# EAGLE design Eddy Backplane (EAGLE 9.5.2)

## Sheet 1 of 3: Back Plane
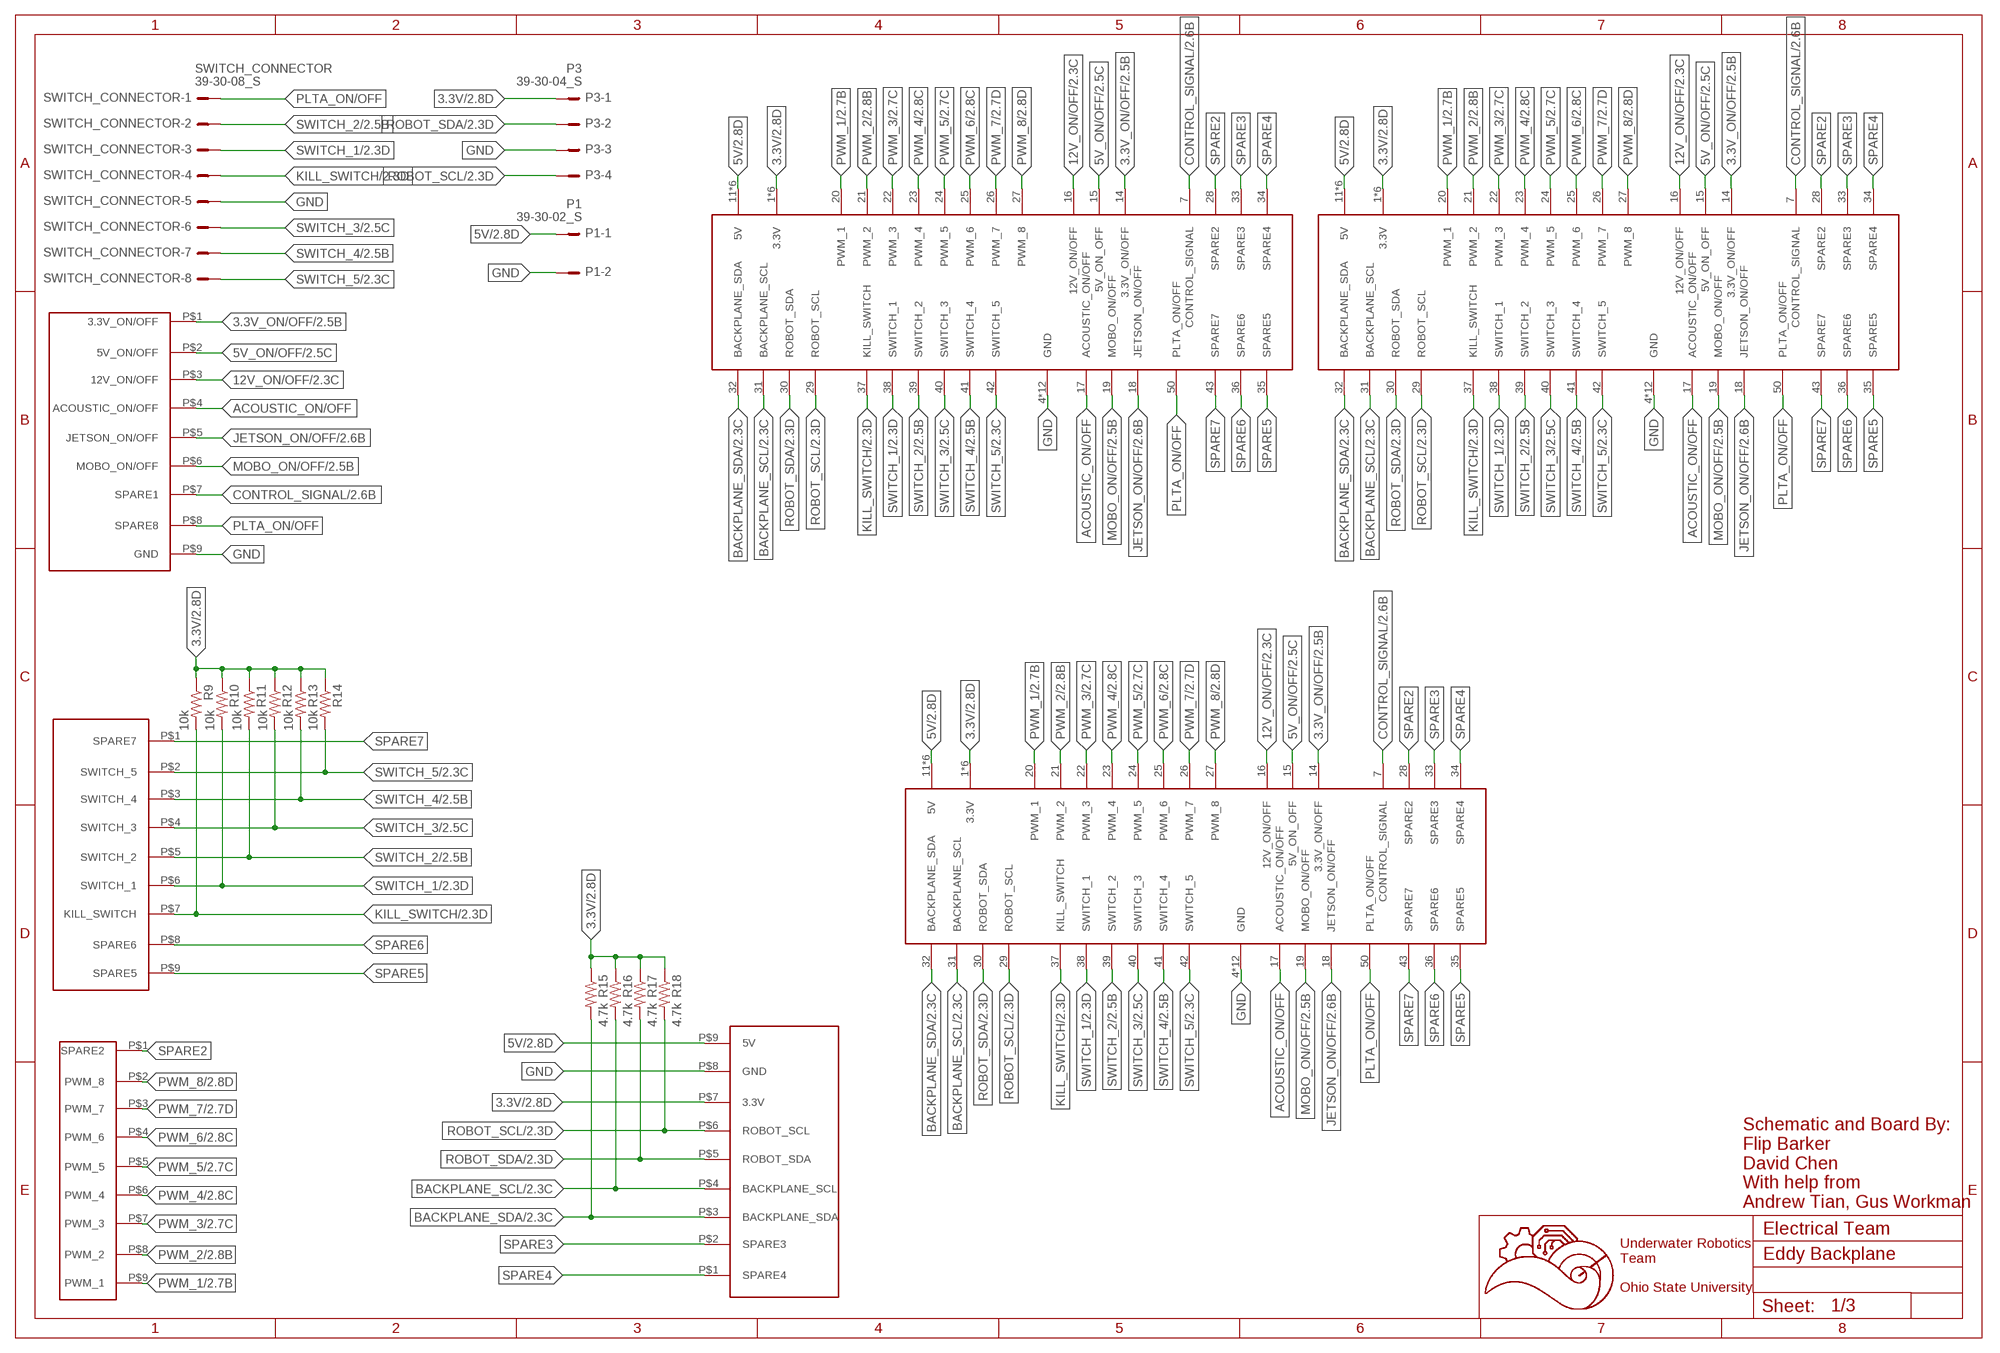
[diagram p0: schematic, sheet 1]

### Parts
P1  39-30-02_S  [39-30-?02?]
P3  39-30-04_S  [39-30-?04?]
PWR_ON  929870-01-09_3  [929852-01-09_1ROW]
R9  10k  R-US_R0603  [R0603]
R10  10k  R-US_R0603  [R0603]
R11  10k  R-US_R0603  [R0603]
R12  10k  R-US_R0603  [R0603]
R13  10k  R-US_R0603  [R0603]
R14  10k  R-US_R0603  [R0603]
R15  4.7k  R-US_R0603  [R0603]
R16  4.7k  R-US_R0603  [R0603]
R17  4.7k  R-US_R0603  [R0603]
R18  4.7k  R-US_R0603  [R0603]
SWITCH_CONN  929870-01-09_1  [929852-01-09_1ROW]
SWITCH_CONNECTOR  39-30-08_S  [39-30-?08?]
U$1  5530843-FEMALE  [5530843-6-BACKPLANEMATE]
U$2  5530843-FEMALE  [5530843-6-BACKPLANEMATE]
U$3  5530843-FEMALE  [5530843-6-BACKPLANEMATE]
U$6  929870-01-09_2  [929852-01-09_1ROW]
U$8  929870-01-09_4  [929852-01-09_1ROW]

### Nets
3.3V: P3.1 R9.1 R10.1 R11.1 R12.1 R13.1 R14.1 R15.1 R16.1 R17.1 R18.1 U$1.1(3.3V) U$1.2(3.3V) U$1.3(3.3V) U$1.54(3.3V) U$1.55(3.3V) U$1.56(3.3V) U$2.1(3.3V) U$2.2(3.3V) U$2.3(3.3V) U$2.54(3.3V) U$2.55(3.3V) U$2.56(3.3V) U$3.1(3.3V) U$3.2(3.3V) U$3.3(3.3V) U$3.54(3.3V) U$3.55(3.3V) U$3.56(3.3V) U$8.P$7(3.3V) ; also sheet 2,3
3.3V_ON/OFF: PWR_ON.P$1(3.3V_ON/OFF) U$1.14(3.3V_ON/OFF) U$2.14(3.3V_ON/OFF) U$3.14(3.3V_ON/OFF) ; also sheet 2
5V: P1.1 U$1.11(5V) U$1.12(5V) U$1.13(5V) U$1.44(5V) U$1.45(5V) U$1.46(5V) U$2.11(5V) U$2.12(5V) U$2.13(5V) U$2.44(5V) U$2.45(5V) U$2.46(5V) U$3.11(5V) U$3.12(5V) U$3.13(5V) U$3.44(5V) U$3.45(5V) U$3.46(5V) U$8.P$9(5V) ; also sheet 2
5V_ON/OFF: PWR_ON.P$2(5V_ON/OFF) U$1.15(5V_ON_OFF) U$2.15(5V_ON_OFF) U$3.15(5V_ON_OFF) ; also sheet 2
12V_ON/OFF: PWR_ON.P$3(12V_ON/OFF) U$1.16(12V_ON/OFF) U$2.16(12V_ON/OFF) U$3.16(12V_ON/OFF) ; also sheet 2
ACOUSTIC_ON/OFF: PWR_ON.P$4(ACOUSTIC_ON/OFF) U$1.17(ACOUSTIC_ON/OFF) U$2.17(ACOUSTIC_ON/OFF) U$3.17(ACOUSTIC_ON/OFF)
BACKPLANE_SCL: R16.2 U$1.31(BACKPLANE_SCL) U$2.31(BACKPLANE_SCL) U$3.31(BACKPLANE_SCL) U$8.P$4(BACKPLANE_SCL) ; also sheet 2
BACKPLANE_SDA: R15.2 U$1.32(BACKPLANE_SDA) U$2.32(BACKPLANE_SDA) U$3.32(BACKPLANE_SDA) U$8.P$3(BACKPLANE_SDA) ; also sheet 2
CONTROL_SIGNAL: PWR_ON.P$7(SPARE1) U$1.7(CONTROL_SIGNAL) U$2.7(CONTROL_SIGNAL) U$3.7(CONTROL_SIGNAL) ; also sheet 2
GND: P1.2 P3.3 PWR_ON.P$9(GND) SWITCH_CONNECTOR.5 U$1.4(GND) U$1.5(GND) U$1.6(GND) U$1.8(GND) U$1.9(GND) U$1.10(GND) U$1.47(GND) U$1.48(GND) U$1.49(GND) U$1.51(GND) U$1.52(GND) U$1.53(GND) U$2.4(GND) U$2.5(GND) U$2.6(GND) U$2.8(GND) U$2.9(GND) U$2.10(GND) U$2.47(GND) U$2.48(GND) U$2.49(GND) U$2.51(GND) U$2.52(GND) U$2.53(GND) U$3.4(GND) U$3.5(GND) U$3.6(GND) U$3.8(GND) U$3.9(GND) U$3.10(GND) U$3.47(GND) U$3.48(GND) U$3.49(GND) U$3.51(GND) U$3.52(GND) U$3.53(GND) U$8.P$8(GND) ; also sheet 2,3
JETSON_ON/OFF: PWR_ON.P$5(JETSON_ON/OFF) U$1.18(JETSON_ON/OFF) U$2.18(JETSON_ON/OFF) U$3.18(JETSON_ON/OFF) ; also sheet 2
KILL_SWITCH: R9.2 SWITCH_CONN.P$7(KILL_SWITCH) SWITCH_CONNECTOR.4 U$1.37(KILL_SWITCH) U$2.37(KILL_SWITCH) U$3.37(KILL_SWITCH) ; also sheet 2
MOBO_ON/OFF: PWR_ON.P$6(MOBO_ON/OFF) U$1.19(MOBO_ON/OFF) U$2.19(MOBO_ON/OFF) U$3.19(MOBO_ON/OFF) ; also sheet 2
PLTA_ON/OFF: PWR_ON.P$8(SPARE8) SWITCH_CONNECTOR.1 U$1.50(PLTA_ON/OFF) U$2.50(PLTA_ON/OFF) U$3.50(PLTA_ON/OFF)
PWM_1: U$1.20(PWM_1) U$2.20(PWM_1) U$3.20(PWM_1) U$6.P$9(PWM_1) ; also sheet 2
PWM_2: U$1.21(PWM_2) U$2.21(PWM_2) U$3.21(PWM_2) U$6.P$8(PWM_2) ; also sheet 2
PWM_3: U$1.22(PWM_3) U$2.22(PWM_3) U$3.22(PWM_3) U$6.P$7(PWM_3) ; also sheet 2
PWM_4: U$1.23(PWM_4) U$2.23(PWM_4) U$3.23(PWM_4) U$6.P$6(PWM_4) ; also sheet 2
PWM_5: U$1.24(PWM_5) U$2.24(PWM_5) U$3.24(PWM_5) U$6.P$5(PWM_5) ; also sheet 2
PWM_6: U$1.25(PWM_6) U$2.25(PWM_6) U$3.25(PWM_6) U$6.P$4(PWM_6) ; also sheet 2
PWM_7: U$1.26(PWM_7) U$2.26(PWM_7) U$3.26(PWM_7) U$6.P$3(PWM_7) ; also sheet 2
PWM_8: U$1.27(PWM_8) U$2.27(PWM_8) U$3.27(PWM_8) U$6.P$2(PWM_8) ; also sheet 2
ROBOT_SCL: P3.4 R18.2 U$1.29(ROBOT_SCL) U$2.29(ROBOT_SCL) U$3.29(ROBOT_SCL) U$8.P$6(ROBOT_SCL) ; also sheet 2
ROBOT_SDA: P3.2 R17.2 U$1.30(ROBOT_SDA) U$2.30(ROBOT_SDA) U$3.30(ROBOT_SDA) U$8.P$5(ROBOT_SDA) ; also sheet 2
SPARE2: U$1.28(SPARE2) U$2.28(SPARE2) U$3.28(SPARE2) U$6.P$1(SPARE2)
SPARE3: U$1.33(SPARE3) U$2.33(SPARE3) U$3.33(SPARE3) U$8.P$2(SPARE3)
SPARE4: U$1.34(SPARE4) U$2.34(SPARE4) U$3.34(SPARE4) U$8.P$1(SPARE4)
SPARE5: SWITCH_CONN.P$9(SPARE5) U$1.35(SPARE5) U$2.35(SPARE5) U$3.35(SPARE5)
SPARE6: SWITCH_CONN.P$8(SPARE6) U$1.36(SPARE6) U$2.36(SPARE6) U$3.36(SPARE6)
SPARE7: SWITCH_CONN.P$1(SPARE7) U$1.43(SPARE7) U$2.43(SPARE7) U$3.43(SPARE7)
SWITCH_1: R10.2 SWITCH_CONN.P$6(SWITCH_1) SWITCH_CONNECTOR.3 U$1.38(SWITCH_1) U$2.38(SWITCH_1) U$3.38(SWITCH_1) ; also sheet 2
SWITCH_2: R11.2 SWITCH_CONN.P$5(SWITCH_2) SWITCH_CONNECTOR.2 U$1.39(SWITCH_2) U$2.39(SWITCH_2) U$3.39(SWITCH_2) ; also sheet 2
SWITCH_3: R12.2 SWITCH_CONN.P$4(SWITCH_3) SWITCH_CONNECTOR.6 U$1.40(SWITCH_3) U$2.40(SWITCH_3) U$3.40(SWITCH_3) ; also sheet 2
SWITCH_4: R13.2 SWITCH_CONN.P$3(SWITCH_4) SWITCH_CONNECTOR.7 U$1.41(SWITCH_4) U$2.41(SWITCH_4) U$3.41(SWITCH_4) ; also sheet 2
SWITCH_5: R14.2 SWITCH_CONN.P$2(SWITCH_5) SWITCH_CONNECTOR.8 U$1.42(SWITCH_5) U$2.42(SWITCH_5) U$3.42(SWITCH_5) ; also sheet 2

### Notes on the sheet
- Schematic and Board By:
  Flip Barker
  David Chen
  With help from 
  Andrew Tian, Gus Workman
- Electrical Team
- Underwater Robotics
  Team
  
  Ohio State University

## Sheet 2 of 3: Microcontroller
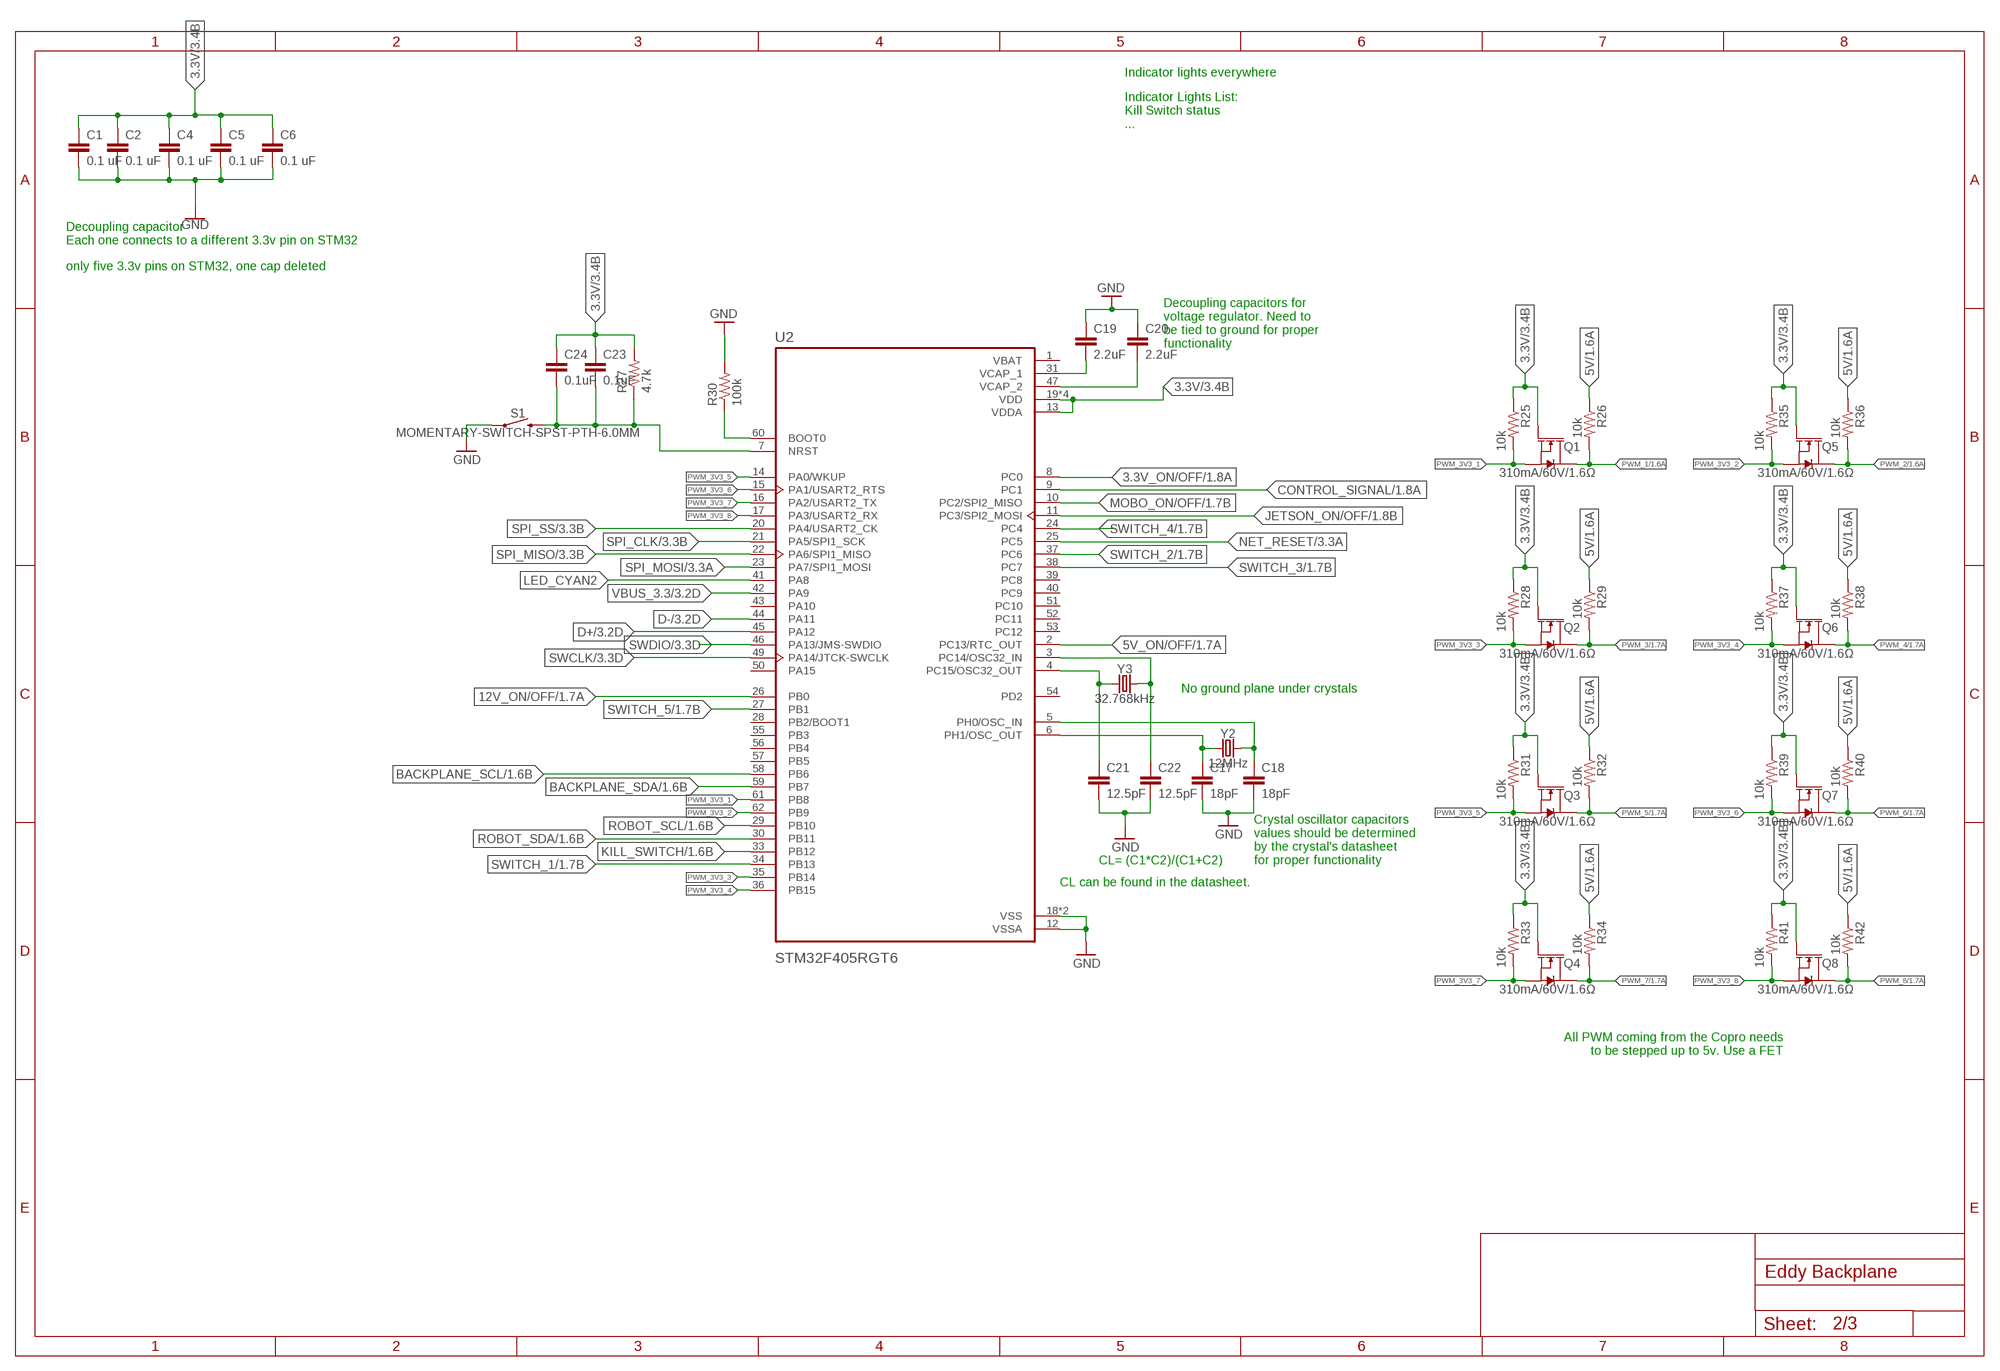
[diagram p1: schematic, sheet 2]

### Parts
C1  0.1 uF  C-EUC0603  [C0603]
C2  0.1 uF  C-EUC0603  [C0603]
C4  0.1 uF  C-EUC0603  [C0603]
C5  0.1 uF  C-EUC0603  [C0603]
C6  0.1 uF  C-EUC0603  [C0603]
C17  18pF  C-EUC0603  [C0603]
C18  18pF  C-EUC0603  [C0603]
C19  2.2uF  C-EUC0603  [C0603]
C20  2.2uF  C-EUC0603  [C0603]
C21  12.5pF  C-EUC0603  [C0603]
C22  12.5pF  C-EUC0603  [C0603]
C23  0.1uF  C-EUC0603  [C0603]
C24  0.1uF  C-EUC0603  [C0603]
Q1  310mA/60V/1.6Ω  MOSFET-NCH-2N7002PW  [SOT323]
Q2  310mA/60V/1.6Ω  MOSFET-NCH-2N7002PW  [SOT323]
Q3  310mA/60V/1.6Ω  MOSFET-NCH-2N7002PW  [SOT323]
Q4  310mA/60V/1.6Ω  MOSFET-NCH-2N7002PW  [SOT323]
Q5  310mA/60V/1.6Ω  MOSFET-NCH-2N7002PW  [SOT323]
Q6  310mA/60V/1.6Ω  MOSFET-NCH-2N7002PW  [SOT323]
Q7  310mA/60V/1.6Ω  MOSFET-NCH-2N7002PW  [SOT323]
Q8  310mA/60V/1.6Ω  MOSFET-NCH-2N7002PW  [SOT323]
R25  10k  R-US_R0603  [R0603]
R26  10k  R-US_R0603  [R0603]
R27  4.7k  R-US_R0603  [R0603]
R28  10k  R-US_R0603  [R0603]
R29  10k  R-US_R0603  [R0603]
R30  100k  R-US_R0603  [R0603]
R31  10k  R-US_R0603  [R0603]
R32  10k  R-US_R0603  [R0603]
R33  10k  R-US_R0603  [R0603]
R34  10k  R-US_R0603  [R0603]
R35  10k  R-US_R0603  [R0603]
R36  10k  R-US_R0603  [R0603]
R37  10k  R-US_R0603  [R0603]
R38  10k  R-US_R0603  [R0603]
R39  10k  R-US_R0603  [R0603]
R40  10k  R-US_R0603  [R0603]
R41  10k  R-US_R0603  [R0603]
R42  10k  R-US_R0603  [R0603]
S1  MOMENTARY-SWITCH-SPST-PTH-6.0MM  [TACTILE_SWITCH_PTH_6.0MM]
U2  STM32F405RGT6  [QFP50P1200X1200X160-64N]
Y2  12MHz  CRYSTAL-16MHZPTH-HC49US  [HC49US]
Y3  32.768kHz  CRYSTAL-32.768KHZSMD-3.2X1.5  [CRYSTAL-SMD-3.2X1.5MM]

### Nets
3.3V: C1.1 C2.1 C4.1 C5.1 C6.1 C23.1 C24.1 Q1.1(G) Q2.1(G) Q3.1(G) Q4.1(G) Q5.1(G) Q6.1(G) Q7.1(G) Q8.1(G) R25.1 R27.2 R28.1 R31.1 R33.1 R35.1 R37.1 R39.1 R41.1 U2.13(VDDA) U2.19(VDD) U2.32(VDD) U2.48(VDD) U2.64(VDD) ; also sheet 1,3
3.3V_ON/OFF: U2.8(PC0) ; also sheet 1
5V: R26.1 R29.1 R32.1 R34.1 R36.1 R38.1 R40.1 R42.1 ; also sheet 1
5V_ON/OFF: U2.2(PC13/RTC_OUT) ; also sheet 1
12V_ON/OFF: U2.26(PB0) ; also sheet 1
BACKPLANE_SCL: U2.58(PB6) ; also sheet 1
BACKPLANE_SDA: U2.59(PB7) ; also sheet 1
CONTROL_SIGNAL: U2.9(PC1) ; also sheet 1
D+: U2.45(PA12) ; also sheet 3
D-: U2.44(PA11) ; also sheet 3
GND: C1.2 C2.2 C4.2 C5.2 C6.2 C17.2 C18.2 C19.1 C20.1 C21.2 C22.2 R30.2 S1.1 U2.12(VSSA) U2.18(VSS) U2.63(VSS) ; also sheet 1,3
JETSON_ON/OFF: U2.11(PC3/SPI2_MOSI) ; also sheet 1
KILL_SWITCH: U2.33(PB12) ; also sheet 1
LED_CYAN2: U2.41(PA8)
MOBO_ON/OFF: U2.10(PC2/SPI2_MISO) ; also sheet 1
N$17: C17.1 U2.6(PH1/OSC_OUT) Y2.1
N$18: C18.1 U2.5(PH0/OSC_IN) Y2.2
N$19: C20.2 U2.47(VCAP_2)
N$20: C19.2 U2.31(VCAP_1)
N$21: C21.1 U2.4(PC15/OSC32_OUT) Y3.P$1
N$29: C22.1 U2.3(PC14/OSC32_IN) Y3.P$2
N$30: R30.1 U2.60(BOOT0)
N$34: C23.2 C24.2 R27.1 S1.3 U2.7(NRST)
NET_RESET: U2.25(PC5) ; also sheet 3
PWM_1: Q1.3(D) R26.2 ; also sheet 1
PWM_2: Q5.3(D) R36.2 ; also sheet 1
PWM_3: Q2.3(D) R29.2 ; also sheet 1
PWM_3V3_1: Q1.2(S) R25.2 U2.61(PB8)
PWM_3V3_2: Q5.2(S) R35.2 U2.62(PB9)
PWM_3V3_3: Q2.2(S) R28.2 U2.35(PB14)
PWM_3V3_4: Q6.2(S) R37.2 U2.36(PB15)
PWM_3V3_5: Q3.2(S) R31.2 U2.14(PA0/WKUP)
PWM_3V3_6: Q7.2(S) R39.2 U2.15(PA1/USART2_RTS)
PWM_3V3_7: Q4.2(S) R33.2 U2.16(PA2/USART2_TX)
PWM_3V3_8: Q8.2(S) R41.2 U2.17(PA3/USART2_RX)
PWM_4: Q6.3(D) R38.2 ; also sheet 1
PWM_5: Q3.3(D) R32.2 ; also sheet 1
PWM_6: Q7.3(D) R40.2 ; also sheet 1
PWM_7: Q4.3(D) R34.2 ; also sheet 1
PWM_8: Q8.3(D) R42.2 ; also sheet 1
ROBOT_SCL: U2.29(PB10) ; also sheet 1
ROBOT_SDA: U2.30(PB11) ; also sheet 1
SPI_CLK: U2.21(PA5/SPI1_SCK) ; also sheet 3
SPI_MISO: U2.22(PA6/SPI1_MISO) ; also sheet 3
SPI_MOSI: U2.23(PA7/SPI1_MOSI) ; also sheet 3
SPI_SS: U2.20(PA4/USART2_CK) ; also sheet 3
SWCLK: U2.49(PA14/JTCK-SWCLK) ; also sheet 3
SWDIO: U2.46(PA13/JMS-SWDIO) ; also sheet 3
SWITCH_1: U2.34(PB13) ; also sheet 1
SWITCH_2: U2.37(PC6) ; also sheet 1
SWITCH_3: U2.38(PC7) ; also sheet 1
SWITCH_4: U2.24(PC4) ; also sheet 1
SWITCH_5: U2.27(PB1) ; also sheet 1
VBUS_3.3: U2.42(PA9) ; also sheet 3
Unconnected: U2.28(PB2/BOOT1) U2.39(PC8) U2.40(PC9) U2.43(PA10) U2.50(PA15) U2.51(PC10) U2.52(PC11) U2.53(PC12) U2.54(PD2) U2.55(PB3) U2.56(PB4) U2.57(PB5)

### Notes on the sheet
- Indicator lights everywhere
- Indicator Lights List:
  Kill Switch status
  ...
- Decoupling capacitor
  Each one connects to a different 3.3v pin on STM32
- only five 3.3v pins on STM32, one cap deleted
- Decoupling capacitors for 
  voltage regulator. Need to
  be tied to ground for proper
  functionality
- No ground plane under crystals
- CL= (C1*C2)/(C1+C2)
- Crystal oscillator capacitors
  values should be determined
  by the crystal's datasheet
  for proper functionality
- CL can be found in the datasheet.
- All PWM coming from the Copro needs
  to be stepped up to 5v. Use a FET

## Sheet 3 of 3: Connectors
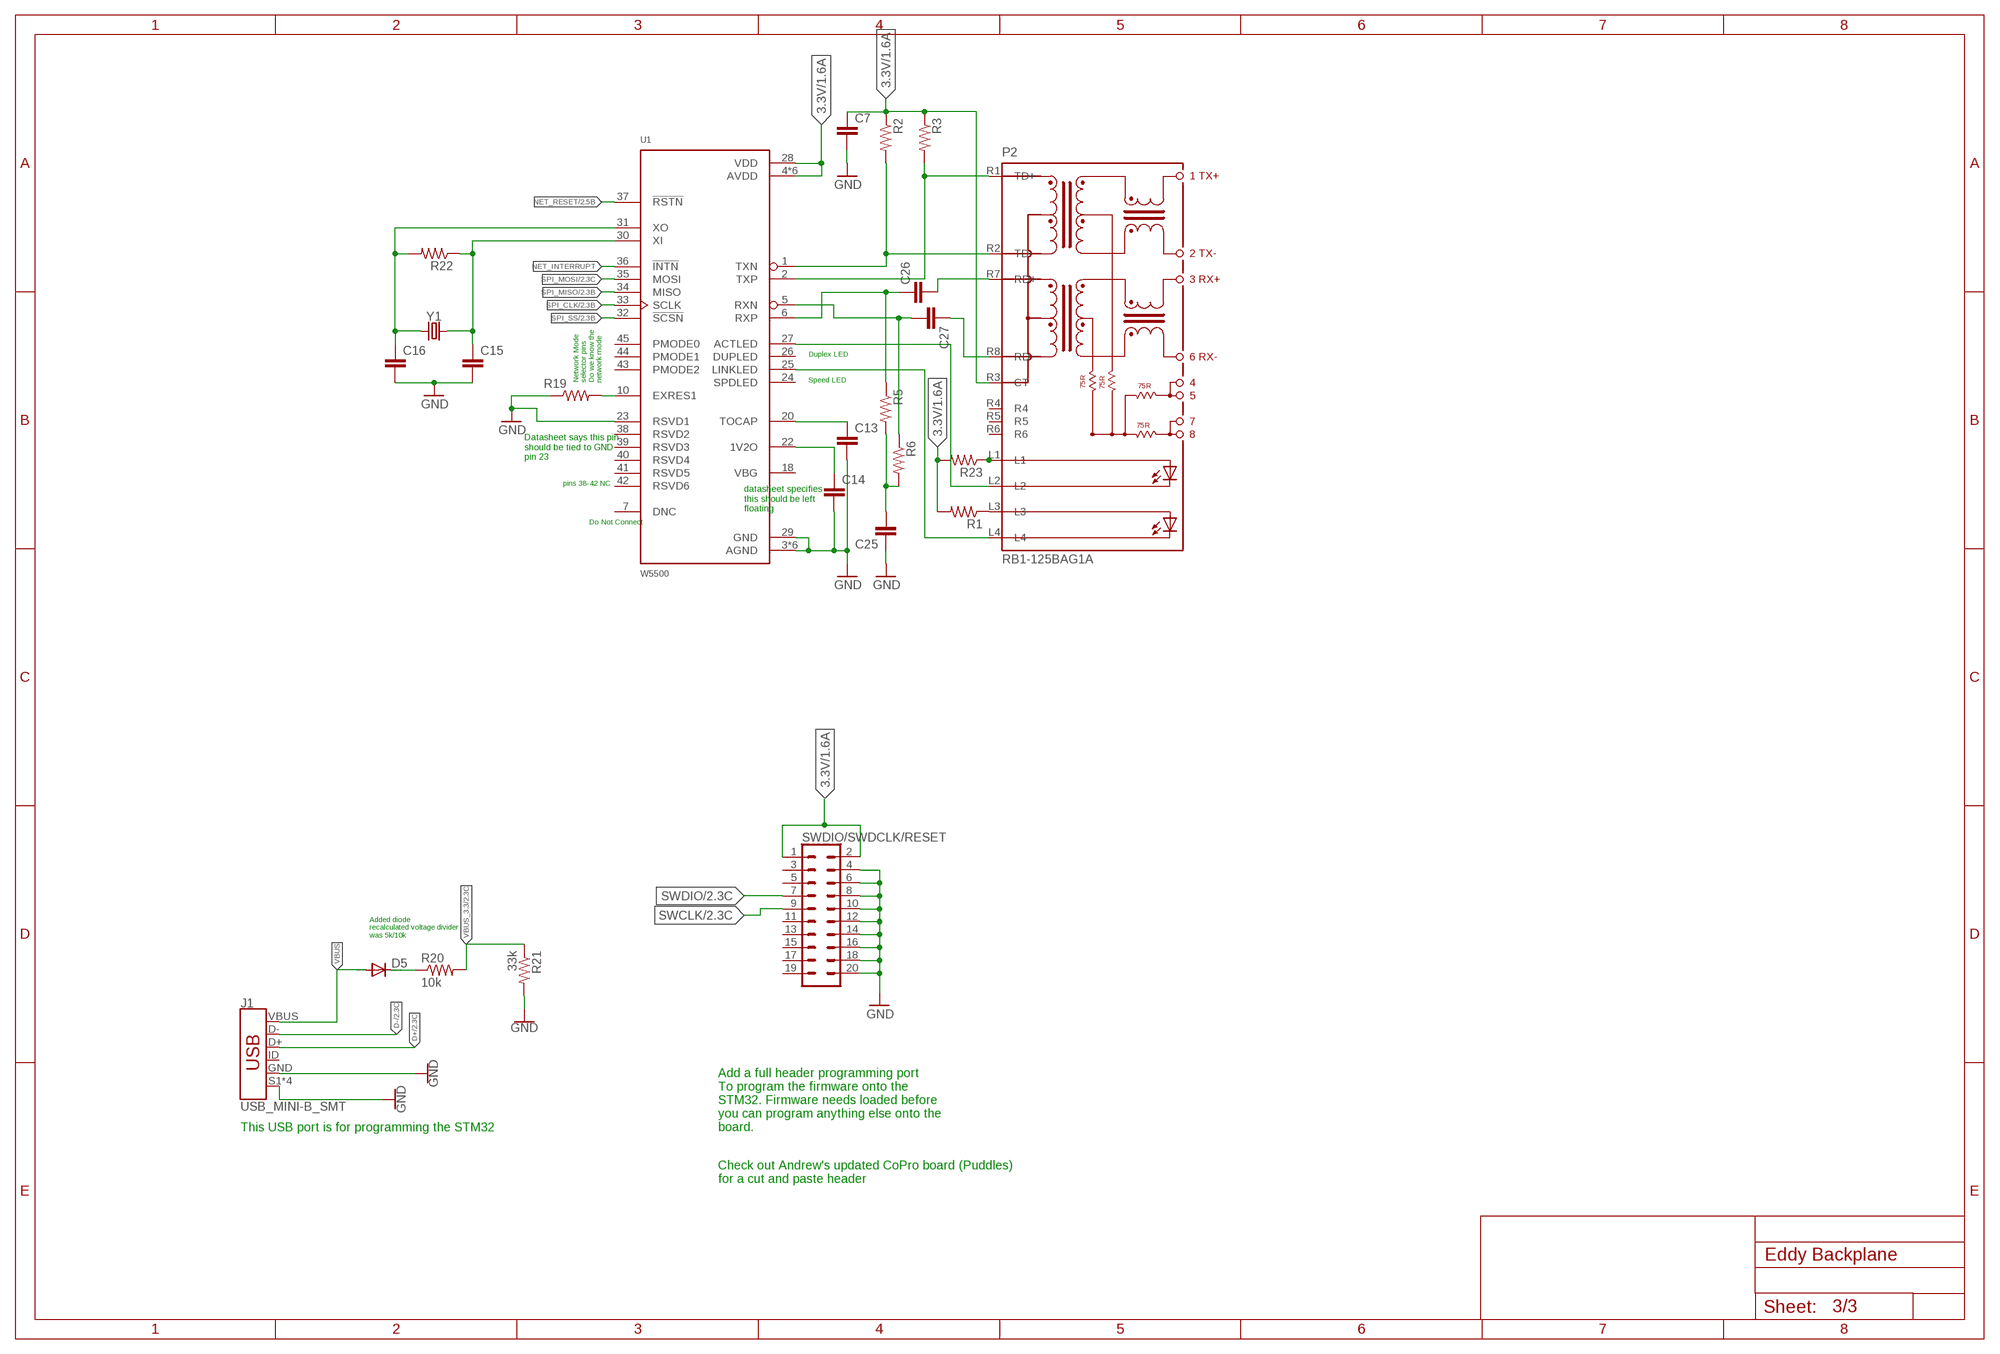
[diagram p2: schematic, sheet 3]

### Parts
C7  C-EUC0603  [C0603]
C13  C-EUC0603  [C0603]
C14  C-EUC0603  [C0603]
C15  C-EUC0603  [C0603]
C16  C-EUC0603  [C0603]
C25  C-EUC0603  [C0603]
C26  C-EUC0603  [C0603]
C27  C-EUC0603  [C0603]
D5  DIODE-SMB  [SMB]
J1  USB_MINI-B_SMT  [USB-MINIB]
P2  RB1-125BAG1A  [WIZNET_RB1-125BAG1A]
R1  R-US_R0603  [R0603]
R2  R-US_R0603  [R0603]
R3  R-US_R0603  [R0603]
R5  R-US_R0603  [R0603]
R6  R-US_R0603  [R0603]
R19  R-US_R0603  [R0603]
R20  10k  R-US_R0603  [R0603]
R21  33k  R-US_R0603  [R0603]
R22  R-US_R0603  [R0603]
R23  R-US_R0603  [R0603]
SWDIO/SWDCLK/RESET  CONN_10X2  [2X10]
U1  W5500  [QFP50P900X900X160-48N]
Y1  CRYSTALPTH-HC49US  [HC49US]

### Nets
3.3V: C7.1 P2.R3(CT) R1.2 R2.1 R3.1 R23.2 SWDIO/SWDCLK/RESET.1 SWDIO/SWDCLK/RESET.2 U1.4(AVDD) U1.8(AVDD) U1.11(AVDD) U1.15(AVDD) U1.17(AVDD) U1.21(AVDD) U1.28(VDD) ; also sheet 1,2
D+: J1.D+ ; also sheet 2
D-: J1.D- ; also sheet 2
GND: C7.2 C13.2 C14.2 C15.2 C16.2 C25.1 J1.GND J1.S1(SHIELD) J1.S2(SHIELD) J1.S3(SHIELD) J1.S4(SHIELD) R19.1 R21.2 SWDIO/SWDCLK/RESET.4 SWDIO/SWDCLK/RESET.6 SWDIO/SWDCLK/RESET.8 SWDIO/SWDCLK/RESET.10 SWDIO/SWDCLK/RESET.12 SWDIO/SWDCLK/RESET.14 SWDIO/SWDCLK/RESET.16 SWDIO/SWDCLK/RESET.18 SWDIO/SWDCLK/RESET.20 U1.3(AGND) U1.9(AGND) U1.14(AGND) U1.16(AGND) U1.19(AGND) U1.23(RSVD1) U1.29(GND) U1.48(AGND) ; also sheet 1,2
N$4: C14.1 U1.22(1V2O)
N$8: D5.C R20.1
N$9: C15.1 R22.1 U1.30(XI) Y1.2
N$10: C16.1 R22.2 U1.31(XO) Y1.1
N$11: P2.L4 U1.25(LINKLED)
N$12: P2.L2 U1.27(ACTLED)
N$13: C13.1 U1.20(TOCAP)
N$14: R19.2 U1.10(EXRES1)
N$15: P2.L1 R23.1
N$16: P2.L3 R1.1
N$22: C25.2 R5.2 R6.2
N$23: P2.R1(TD+) R3.2 U1.2(TXP)
N$24: P2.R2(TD-) R2.2 U1.1(TXN)
N$25: C26.2 P2.R7(RD+)
N$26: C26.1 R5.1 U1.6(RXP)
N$27: C27.2 R6.1 U1.5(RXN)
N$28: C27.1 P2.R8(RD-)
NET_INTERRUPT: U1.36(!INTN)
NET_RESET: U1.37(!RSTN) ; also sheet 2
SPI_CLK: U1.33(SCLK) ; also sheet 2
SPI_MISO: U1.34(MISO) ; also sheet 2
SPI_MOSI: U1.35(MOSI) ; also sheet 2
SPI_SS: U1.32(!SCSN) ; also sheet 2
SWCLK: SWDIO/SWDCLK/RESET.9 ; also sheet 2
SWDIO: SWDIO/SWDCLK/RESET.7 ; also sheet 2
VBUS: D5.A J1.VBUS
VBUS_3.3: R20.2 R21.1 ; also sheet 2
Unconnected: J1.ID P2.R4 P2.R5 P2.R6 SWDIO/SWDCLK/RESET.3 SWDIO/SWDCLK/RESET.5 SWDIO/SWDCLK/RESET.11 SWDIO/SWDCLK/RESET.13 SWDIO/SWDCLK/RESET.15 SWDIO/SWDCLK/RESET.17 SWDIO/SWDCLK/RESET.19 U1.7(DNC) U1.18(VBG) U1.24(SPDLED) U1.26(DUPLED) U1.38(RSVD2) U1.39(RSVD3) U1.40(RSVD4) U1.41(RSVD5) U1.42(RSVD6) U1.43(PMODE2) U1.44(PMODE1) U1.45(PMODE0)

### Notes on the sheet
- Duplex LED
- Network Mode
  selector pins
  Do we know the
  network mode
- Speed LED
- Datasheet says this pin
  should be tied to GND
  pin 23
- pins 38-42 NC
- datasheet specifies
  this should be left
  floating
- Do Not Connect
- Added diode
  recalculated voltage divider
  was 5k/10k
- This USB port is for programming the STM32
- Add a full header programming port
  To program the firmware onto the 
  STM32. Firmware needs loaded before
  you can program anything else onto the 
  board.
- Check out Andrew's updated CoPro board (Puddles)
  for a cut and paste header

## Power pins joined to a net without a drawn wire
VBAT: U2.1(VBAT)

## Library data of the parts
C1 C2 C4-C7 C13-C27 = rcl:C-EU: CAPACITOR, European symbol; SPICEPREFIX: C
D5 = diode:DIODE-: DIODE
J1 = SparkFun-Connectors:USB_MINI-B: USB type Mini-B Connector Breaks out 5th pin, and includes shield pins if needed. SparkFun Products: SparkFun FTDI Basic Breakout <https://www.sparkfun.com/products/9716> SparkFun XBee Explorer USB <https://www.sparkfun.com/products/11812> SparkFun Redboard <https://www.sparkfun.com/products/12757>; PROD_ID: CONN-08193; SF_ID: PRT-00587
P1 = con-molex-mini-fit:39-30-?02?_S: HEADER
P2 = RJ45-MAGJACK:RB1-125BAG1A: Accessory RJ-45 With Transformer Connector - UDE; AVAILABILITY: Unavailable; DESCRIPTION: Accessory RJ-45 With Transformer Connector - UDE; MF: WIZnet; MP: RB1-125BAG1A; PACKAGE: HVQFN-36 NXP Semiconductors; PRICE: None
P3 = con-molex-mini-fit:39-30-?04?_S: HEADER
PWR_ON = 3M_929852_Connector:929870-01-09_3
Q1-Q8 = SparkFun-DiscreteSemi:MOSFET-NCH: N-channel MOSFETs Voltage controlled devices that allow control of high current outputs. SparkFun Products: SparkFun OpenScale <https://www.sparkfun.com/products/13261> SparkFun Digital Sandbox <https://www.sparkfun.com/products/12651> SparkFun Monster Moto Shield <https://www.sparkfun.com/products/10182> SparkFun MOSFET Power Controller <https://www.sparkfun.com/products/11214>; PROD_ID: TRANS-11151
R1-R3 R5 R6 R9-R23 R25-R42 = rcl:R-US_: RESISTOR, American symbol; SPICEPREFIX: R
S1 = SparkFun-Switches:MOMENTARY-SWITCH-SPST: Momentary Switch (Pushbutton) - SPST Normally-open (NO) SPST momentary switches (buttons, pushbuttons). Variants PTH-12MM - 12mm square, through-hole Momentary Pushbutton Switch - 12mm Square <https://www.sparkfun.com/products/9190> (COM-09190) PTH-6.0MM, PTH-6.0MM-KIT - 6.0mm square, through-hole Mini Pushbutton Switch <https://www.sparkfun.com/products/97> (COM-00097) KIT package intended for soldering kit's - only one side of pads' copper is exposed. PTH-RIGHT-ANGLE-KIT - Right-angle, through-hole Right Angle Tactile Button <https://www.sparkfun.com/products/10791> - Used on SparkFun BigTime Watch Kit <https://www.sparkfun.com/products/11734> SMD-12MM - 12mm square, surface-mount Tactile Button - SMD (12mm) <https://www.sparkfun.com/products/12993> (COM-12993) Used on SparkFun PicoBoard <https://www.sparkfun.com/products/11888> SMD-4.5MM - 4.5mm Square Trackball Switch Used on SparkFun Blackberry Trackballer Breakout <https://www.sparkfun.com/products/13169> SMD-4.6MMX2.8MM - 4.60mm x 2.80mm, surface mount Used on SparkFun SAMD21 Mini Breakout <https://www.sparkfun.com/products/13664> SMD-5.2MM, SMD-5.2-REDUNDANT - 5.2mm square, surface-mount Mini Pushbutton Switch - SMD <https://www.sparkfun.com/products/8720> (COM-08720) Used on Arduino Pro Mini <https://www.sparkfun.com/products/11114> REDUNDANT package connects both switch circuits together SMD-6.0X3.5MM - 6.0 x 3.5mm, surface mount Momentary Reset Switch SMD <https://www.sparkfun.com/products/8229> (COM-08229) SMD-6.2MM-TALL - 6.2mm square, surface mount Tactile Button - SMD (6mm) <https://www.sparkfun.com/products/12992> Used on SparkFun Digital Sandbox <https://www.sparkfun.com/products/12651> SMD-RIGHT-ANGLE - Right-angle, surface mount Used on SparkFun Block for Intel® Edison - Arduino <https://www.sparkfun.com/products/13036>; PROD_ID: SWCH-08441; SF_SKU: COM-00097
SWDIO/SWDCLK/RESET = SparkFun-Connectors:CONN_10X2: Multi connection point. Often used as Generic Header-pin footprint for 0.1 inch spaced/style header connections On any of the 0.1 inch spaced packages, you can populate with these: Break Away Headers - Straight <https://www.sparkfun.com/products/116> (PRT-00116) Break Away Male Headers - Right Angle <https://www.sparkfun.com/products/553> (PRT-00553) Female Headers <https://www.sparkfun.com/products/115> (PRT-00115) Break Away Headers - Machine Pin <https://www.sparkfun.com/products/117> (PRT-00117) Break Away Female Headers - Swiss Machine Pin <https://www.sparkfun.com/products/743> (PRT-00743) Special note about the "SPECIAL" package: This was SPECIALLY designed to be used with our Graphic LCD Backpack. Be sure you want to use this! It is not only staggered on each line of header holes, but IT IS ALSO offset of the center point of the top and bottom lines by 5 mil. This causes the headers to lock into place on the "standard" footprint on the LCD screen. The extra squares on the tdocu layer are there simply to reference other pins (if you were to actually populate a longer header than ten long - this is what we do with the backpacks).
SWITCH_CONN = 3M_929852_Connector:929870-01-09_1
SWITCH_CONNECTOR = con-molex-mini-fit:39-30-?08?_S: HEADER
U1 = W5500:W5500: Hardwired TCP/IP embedded Ethernet controller; AVAILABILITY: Unavailable; DESCRIPTION: Victor Pure White Collection Wood Tidy Tower Organizer; MF: WIZnet; MP: W5500; PACKAGE: LQFP-48 Victor Technologies; PRICE: None
U2 = STM32F405RGT6:STM32F405RGT6: High-performance foundation line, ARM Cortex-M4 core with DSP and FPU, 1 Mbyte Flash, 168 MHz CPU, ART Accelerator; AVAILABILITY: Unavailable; DESCRIPTION: High-performance foundation line, ARM Cortex-M4 core with DSP and FPU, 1 Mbyte Flash, 168 MHz CPU, ART Accelerator; MF: STMicroelectronics; MP: STM32F405RGT6; PACKAGE: LQFP-64 STMicroelectronics; PRICE: None
U$1-U$3 = 5530843-6:5530843-FEMALE
U$6 = 3M_929852_Connector:929870-01-09_2
U$8 = 3M_929852_Connector:929870-01-09_4
Y1 = SparkFun-Clocks:CRYSTAL: Crystals (Generic) These are passive quartz crystals, which can be used as a clock source for a microcontroller. Crystal's are two-terminal devices. They require external "load" capacitors to generate an oscillating signal.
Y2 = SparkFun-Clocks:CRYSTAL-16MHZ: 16MHz Crystal Digikey Example <http://www.digikey.com/product-search/en?keywords=535-9122-1-ND> Frequency: 16MHz Frequency Stability: ±50ppm Frequency Tolerance: ±20ppm Load Capacitance: 18pF SparkFun Products: Pro Micro -5V/16MHz <https://www.sparkfun.com/products/12640> SparkFun Serial Enabled LCD Kit <https://www.sparkfun.com/products/10097>; PROD_ID: XTAL-08181; SF_ID: COM-00536; VALUE: 16MHz
Y3 = SparkFun-Clocks:CRYSTAL-32.768KHZ: 32.768kHz Crystal Frequency: 32.768kHz Frequency Stability: ±20ppm Load Capacitance: 12.5pF (PTH-2X6 & SMD-3.2X1.5), 6pF (SMD-2X6) SparkFun Products: SparkFun BigTime Watch Kit <https://www.sparkfun.com/products/11734> SparkFun nRF52832 Breakout <https://www.sparkfun.com/products/13990> SparkFun Real Time Clock Module <https://www.sparkfun.com/products/12708>; PROD_ID: XTAL-13062

## Board
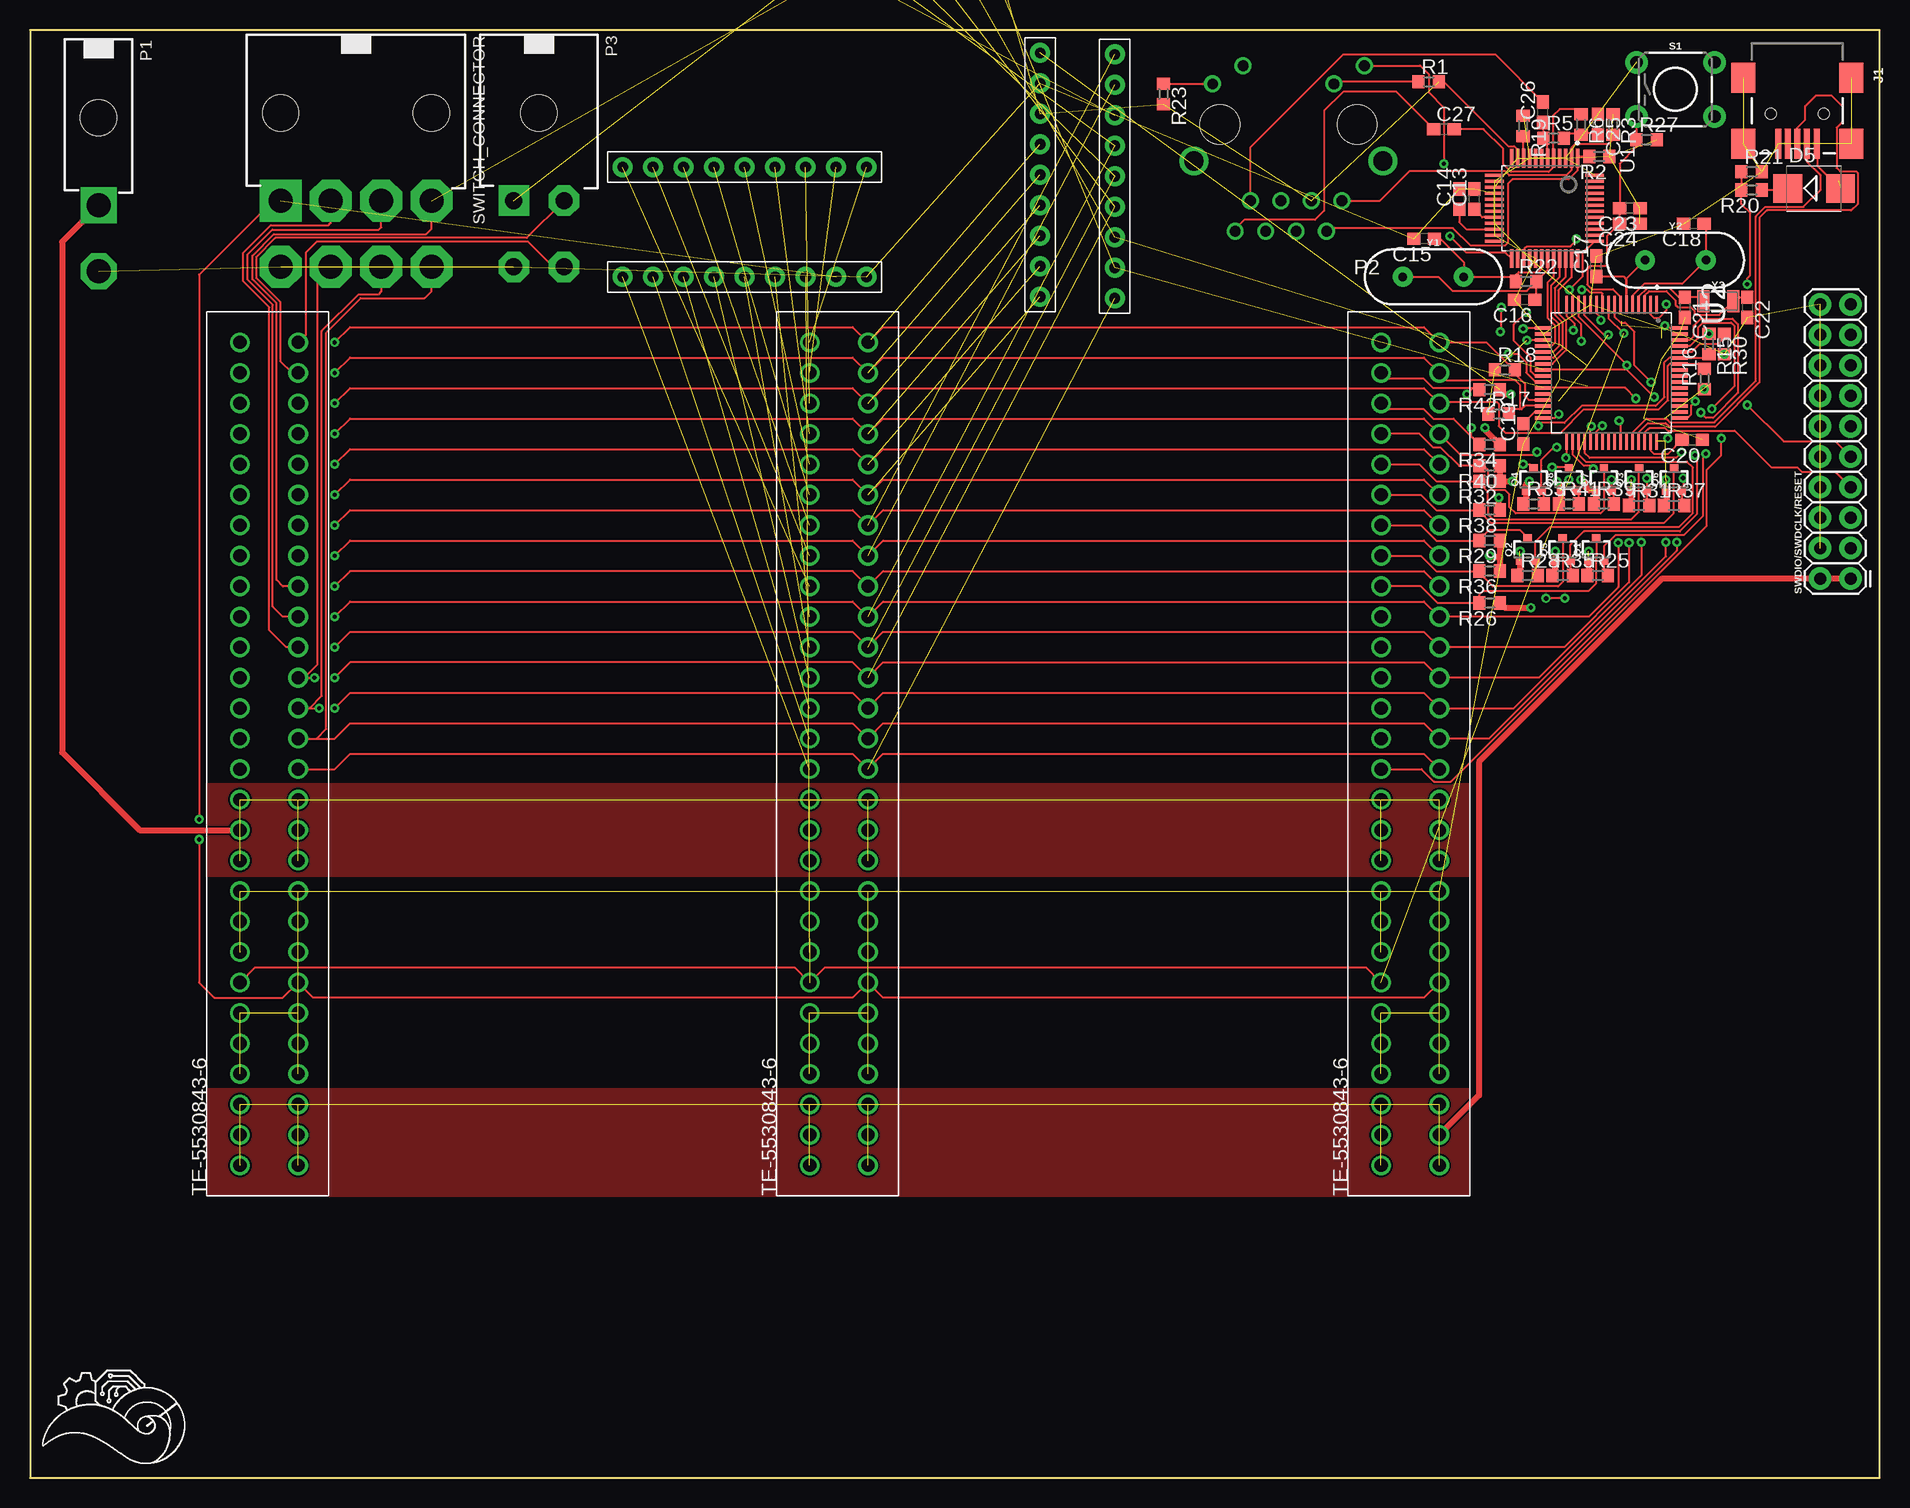
[diagram p3: board, top side]
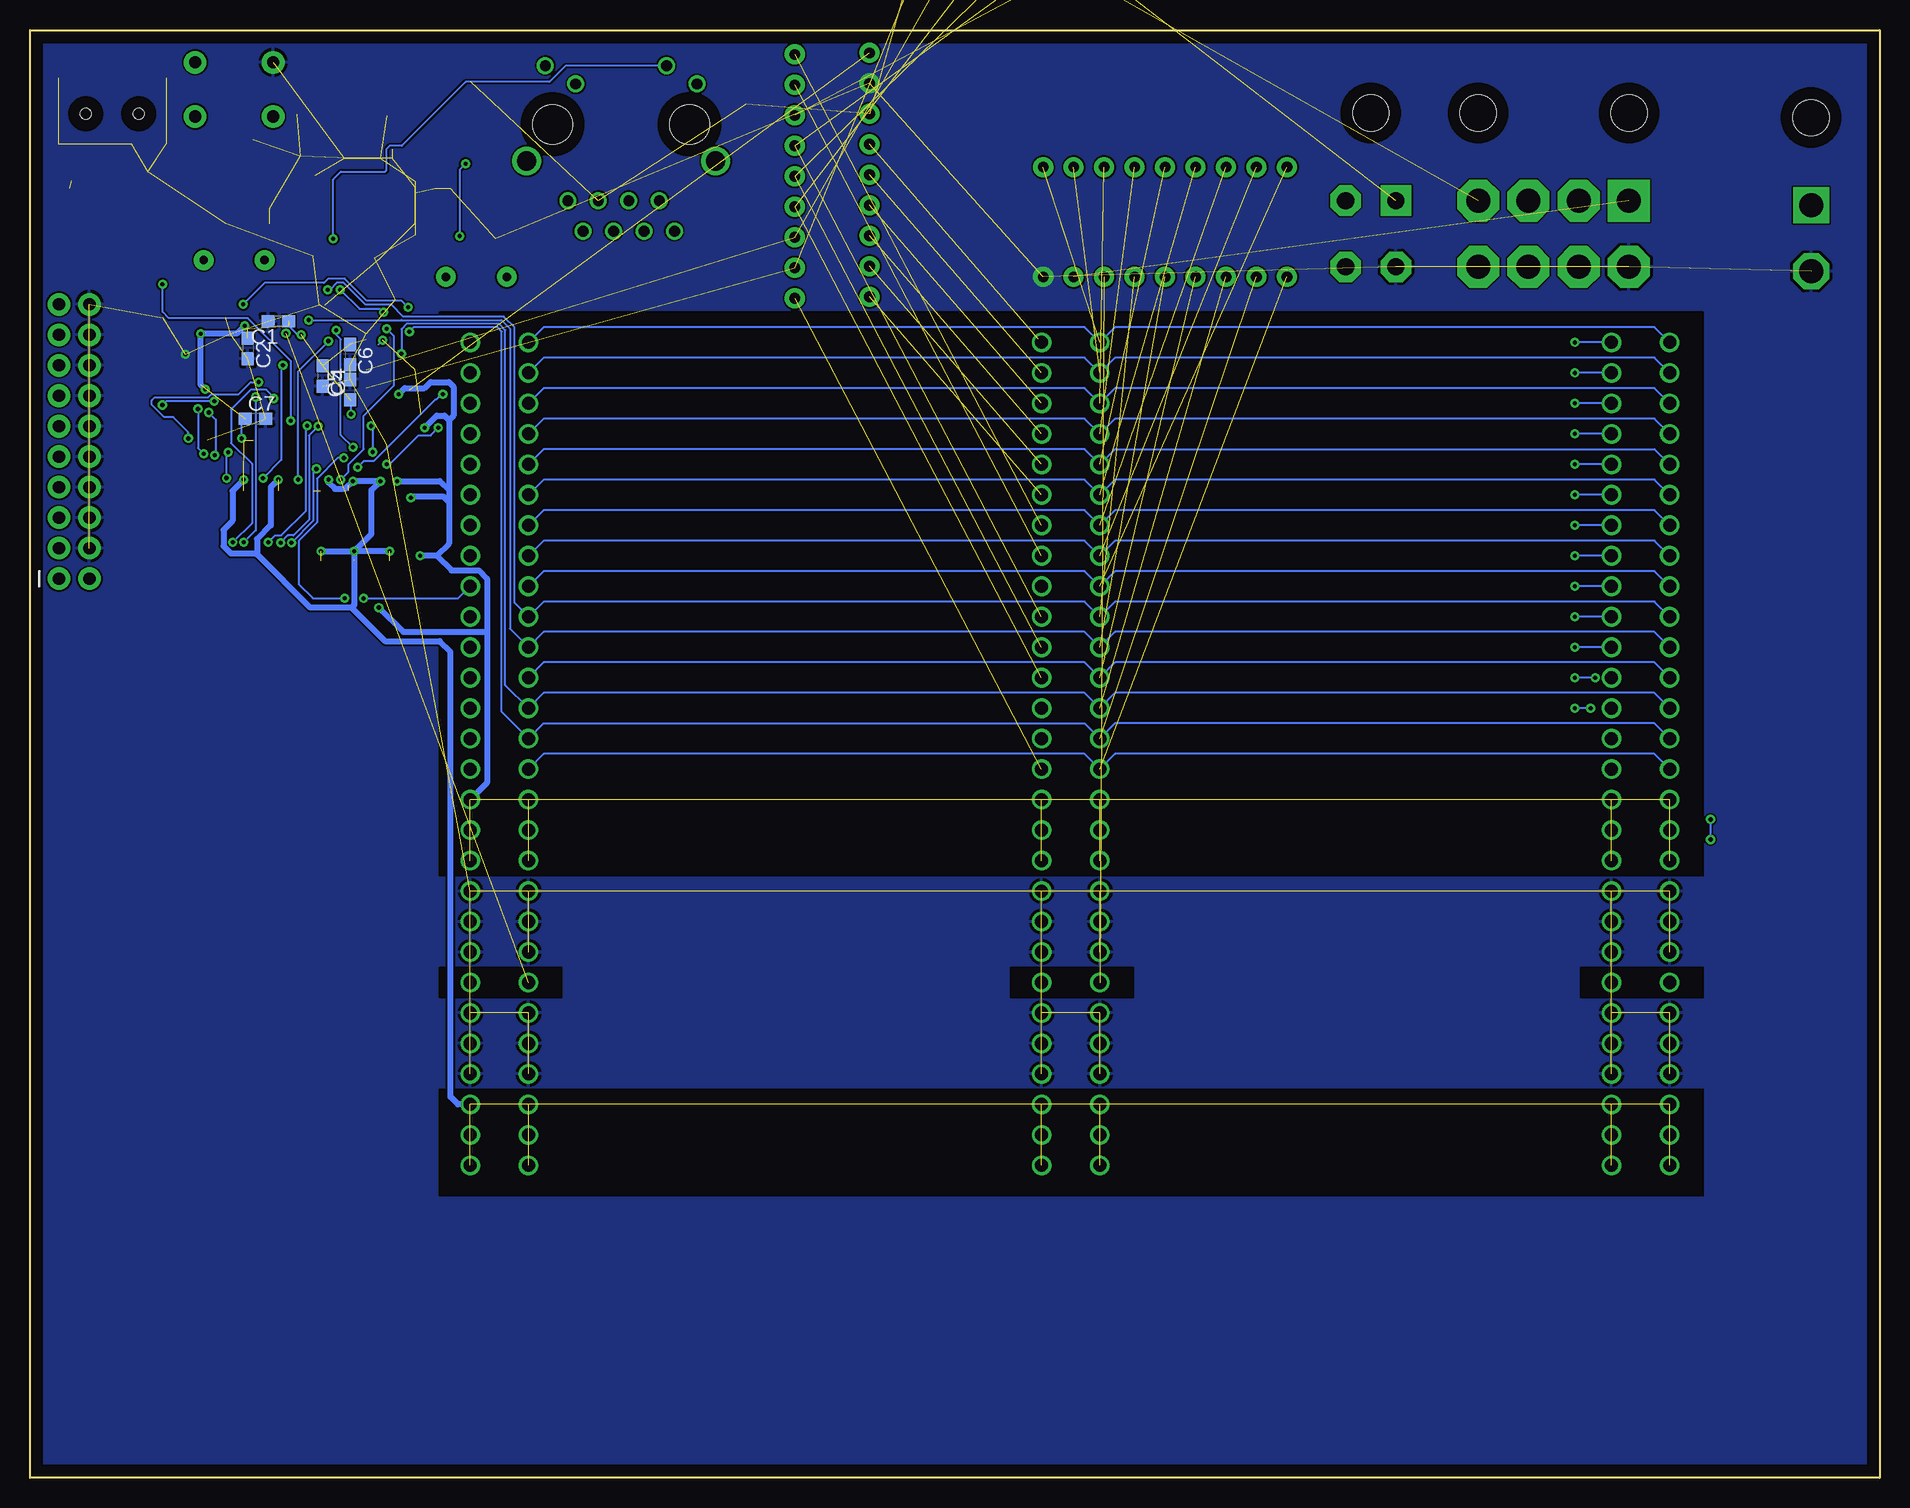
[diagram p4: board, bottom side, seen from below]

Size 154.18 x 120.65 mm. Coordinates in mm from the lower left corner, seen from the top.
Outline: 0,0 154.18,0 154.18,120.65 0,120.65 0,0
Copper layers (1*16): Top 0.035mm / dielectric 1.5mm / Bottom 0.035mm
Design rules "default": minimum track width 6mil, minimum drill 0.35mm, track to track 6mil, track to pad 6mil, pad to pad 6mil, via to via 6mil, smd to smd 6mil, copper to edge 40mil, drill to drill 6mil, minimum pad ring 10mil, minimum via ring 8mil, stop-mask expansion 4mil, vias tented up to drill 0mil, thermal gap 10mil

### Footprints (pad centres in the part's own frame; a part is rotated, then mirrored left to right if it is on the bottom)
C0603 = smd 1.1 x 1: 1 -0.85,0; 2 0.85,0
SMB = smd 2.4 x 2.4: A 2.2,0; C -2.2,0
USB-MINIB = smd 2.5 x 0.5: D+ 2.5,0; D- 2.5,0.8; GND 2.5,-1.6; ID 2.5,-0.8; VBUS 2.5,1.6 | smd 2.5 x 2: S1 -3,4.5; S2 2.5,4.5; S3 -3,-4.5; S4 2.5,-4.5 | hole 0.9: 0,2.2; 0,-2.2
39-30-?02? = drill 2 pad 3 square: 1 0,0 | drill 2 pad 3 octagon: 2 0,5.512 | hole 3: 0,-7.3
WIZNET_RB1-125BAG1A = drill 0.9: L1 6.325,-3.38; L2 3.784,-4.899; L3 -3.786,-3.379; L4 -6.325,-4.9 | drill 0.9 pad 1.3: R1 -4.446,6.349; R2 -3.176,8.889; R3 -1.906,6.349; R4 -0.636,8.889; R5 0.634,6.349; R6 1.904,8.889; R7 3.174,6.349; R8 4.444,8.889 | drill 1.6 pad 2.184: S1 -7.876,3.049; S2 7.874,3.049 | hole 3.3: 5.714,-0.001; -5.716,-0.001
39-30-?04? = drill 1.422 pad 2.54 square: 1 2.095,0 | drill 1.422 pad 2.54 octagon: 2 -2.095,0; 3 2.095,5.512; 4 -2.095,5.512 | hole 3: 0,-7.3
929852-01-09_1ROW = drill 0.889 pad 1.676: P$1 1.27,1.27; P$2 3.81,1.27; P$3 6.35,1.27; P$4 8.89,1.27; P$5 11.43,1.27; P$6 13.97,1.27; P$7 16.51,1.27; P$8 19.05,1.27; P$9 21.59,1.27
SOT323 = smd 0.7 x 0.7: 1 -0.65,-0.925; 2 0.65,-0.925; 3 0,0.925
R0603 = smd 1 x 1.1: 1 -0.85,0; 2 0.85,0
TACTILE_SWITCH_PTH_6.0MM = drill 1.016 pad 1.88: 1 -3.251,2.261; 2 3.251,2.261; 3 -3.251,-2.261; 4 3.251,-2.261
2X10 = drill 1.016 pad 1.88: 1 0,0; 2 0,2.54; 3 2.54,0; 4 2.54,2.54; 5 5.08,0; 6 5.08,2.54; 7 7.62,0; 8 7.62,2.54; 9 10.16,0; 10 10.16,2.54; 11 12.7,0; 12 12.7,2.54; 13 15.24,0; 14 15.24,2.54; 15 17.78,0; 16 17.78,2.54; 17 20.32,0; 18 20.32,2.54; 19 22.86,0; 20 22.86,2.54
39-30-?08? = drill 2 pad 3.5 square: 1 6.287,0 | drill 2 pad 3.5 octagon: 2 2.095,0; 3 -2.095,0; 4 -6.287,0; 5 6.287,5.512; 6 2.095,5.512; 7 -2.095,5.512; 8 -6.287,5.512 | hole 3: -6.287,-7.3; 6.287,-7.3
QFP50P900X900X160-48N = smd 1.56 x 0.28: 1 -4.18,2.75; 2 -4.18,2.25; 3 -4.18,1.75; 4 -4.18,1.25; 5 -4.18,0.75; 6 -4.18,0.25; 7 -4.18,-0.25; 8 -4.18,-0.75; 9 -4.18,-1.25; 10 -4.18,-1.75; 11 -4.18,-2.25; 12 -4.18,-2.75; 25 4.18,-2.75; 26 4.18,-2.25; 27 4.18,-1.75; 28 4.18,-1.25; 29 4.18,-0.75; 30 4.18,-0.25; 31 4.18,0.25; 32 4.18,0.75; 33 4.18,1.25; 34 4.18,1.75; 35 4.18,2.25; 36 4.18,2.75 | smd 0.28 x 1.56: 13 -2.75,-4.18; 14 -2.25,-4.18; 15 -1.75,-4.18; 16 -1.25,-4.18; 17 -0.75,-4.18; 18 -0.25,-4.18; 19 0.25,-4.18; 20 0.75,-4.18; 21 1.25,-4.18; 22 1.75,-4.18; 23 2.25,-4.18; 24 2.75,-4.18; 37 2.75,4.18; 38 2.25,4.18; 39 1.75,4.18; 40 1.25,4.18; 41 0.75,4.18; 42 0.25,4.18; 43 -0.25,4.18; 44 -0.75,4.18; 45 -1.25,4.18; 46 -1.75,4.18; 47 -2.25,4.18; 48 -2.75,4.18
QFP50P1200X1200X160-64N = smd 1.47 x 0.28: 1 -5.67,3.75; 2 -5.67,3.25; 3 -5.67,2.75; 4 -5.67,2.25; 5 -5.67,1.75; 6 -5.67,1.25; 7 -5.67,0.75; 8 -5.67,0.25; 9 -5.67,-0.25; 10 -5.67,-0.75; 11 -5.67,-1.25; 12 -5.67,-1.75; 13 -5.67,-2.25; 14 -5.67,-2.75; 15 -5.67,-3.25; 16 -5.67,-3.75; 33 5.67,-3.75; 34 5.67,-3.25; 35 5.67,-2.75; 36 5.67,-2.25; 37 5.67,-1.75; 38 5.67,-1.25; 39 5.67,-0.75; 40 5.67,-0.25; 41 5.67,0.25; 42 5.67,0.75; 43 5.67,1.25; 44 5.67,1.75; 45 5.67,2.25; 46 5.67,2.75; 47 5.67,3.25; 48 5.67,3.75 | smd 0.28 x 1.47: 17 -3.75,-5.67; 18 -3.25,-5.67; 19 -2.75,-5.67; 20 -2.25,-5.67; 21 -1.75,-5.67; 22 -1.25,-5.67; 23 -0.75,-5.67; 24 -0.25,-5.67; 25 0.25,-5.67; 26 0.75,-5.67; 27 1.25,-5.67; 28 1.75,-5.67; 29 2.25,-5.67; 30 2.75,-5.67; 31 3.25,-5.67; 32 3.75,-5.67; 49 3.75,5.67; 50 3.25,5.67; 51 2.75,5.67; 52 2.25,5.67; 53 1.75,5.67; 54 1.25,5.67; 55 0.75,5.67; 56 0.25,5.67; 57 -0.25,5.67; 58 -0.75,5.67; 59 -1.25,5.67; 60 -1.75,5.67; 61 -2.25,5.67; 62 -2.75,5.67; 63 -3.25,5.67; 64 -3.75,5.67
5530843-6-BACKPLANEMATE = drill 1.092: 1 0,4.851; 2 2.54,4.851; 3 5.08,4.851; 4 7.62,4.851; 5 10.16,4.851; 6 12.7,4.851; 7 15.24,4.851; 8 17.78,4.851; 9 20.32,4.851; 10 22.86,4.851; 11 25.4,4.851; 12 27.94,4.851; 13 30.48,4.851; 14 33.02,4.851; 15 35.56,4.851; 16 38.1,4.851; 17 40.64,4.851; 18 43.18,4.851; 19 45.72,4.851; 20 48.26,4.851; 21 50.8,4.851; 22 53.34,4.851; 23 55.88,4.851; 24 58.42,4.851; 25 60.96,4.851; 26 63.5,4.851; 27 66.04,4.851; 28 68.58,4.851; 29 68.58,0; 30 66.04,0; 31 63.5,0; 32 60.96,0; 33 58.42,0; 34 55.88,0; 35 53.34,0; 36 50.8,0; 37 48.26,0; 38 45.72,0; 39 43.18,0; 40 40.64,0; 41 38.1,0; 42 35.56,0; 43 33.02,0; 44 30.48,0; 45 27.94,0; 46 25.4,0; 47 22.86,0; 48 20.32,0; 49 17.78,0; 50 15.24,0; 51 12.7,0; 52 10.16,0; 53 7.62,0; 54 5.08,0; 55 2.54,0; 56 0,0
HC49US = drill 0.7 pad 1.651: 1 -2.54,0; 2 2.54,0
CRYSTAL-SMD-3.2X1.5MM = smd 1 x 1.8: P$1 -1.25,0; P$2 1.25,0

### Placement (x,y rotation side)
C1  133.48,96.39 180 bottom
C2  136.02,94.11 270 bottom
C4  129.79,91.82 270 bottom
C5  127.51,90.68 90 bottom
C6  127.51,93.6 270 bottom
C7  135.38,88.27 0 bottom
C13  120.4,106.55 90 top
C14  119.13,106.55 90 top
C15  116.2,103.25 180 top
C16  124.59,98.17 180 top
C17  130.56,100.97 90 top
C18  138.68,104.52 180 top
C19  124.46,87 90 top
C20  138.56,86.49 180 top
C21  137.92,97.54 270 top
C22  143.13,97.54 270 top
C23  133.35,105.79 180 top
C24  133.35,104.52 180 top
C25  130.68,112.78 270 top
C26  126.11,113.79 90 top
C27  117.86,112.39 0 top
D5  148.72,107.44 0 top
J1  147.32,113.67 270 top
P1  39-30-02?_S  [39-30-?02?]  5.71,106.05 180 top
P2  104.9,112.78 180 top
P3  39-30-04?_S  [39-30-?04?]  42.42,106.43 180 top
PWR_ON  48.13,98.81 0 top
Q1  130.56,77.34 0 top
Q2  124.84,77.34 0 top
Q3  134.11,83.19 0 top
Q4  125.35,83.19 0 top
Q5  127.76,77.34 0 top
Q6  137.03,83.19 0 top
Q7  131.19,83.19 0 top
Q8  128.27,83.19 0 top
R1  116.59,116.33 0 top
R2  130.81,110.11 180 top
R3  131.95,112.78 270 top
R5  127,111.63 0 top
R6  129.29,112.78 270 top
R9  67.56,126.62 270 top  (outside the outline)
R10  70.1,126.62 270 top  (outside the outline)
R11  72.64,126.62 270 top  (outside the outline)
R12  75.18,126.62 270 top  (outside the outline)
R13  77.72,126.62 270 top  (outside the outline)
R14  80.26,126.62 270 top  (outside the outline)
R15  139.95,94.49 270 top
R16  139.57,91.57 90 top
R17  122.43,88.65 0 top
R18  122.94,92.33 0 top
R19  124.46,112.65 270 top
R20  143.51,107.31 180 top
R21  143.51,108.84 0 top
R22  124.71,99.69 0 top
R23  94.49,115.32 270 top
R25  130.68,75.18 0 top
R26  121.67,72.9 180 top
R27  134.75,111.51 0 top
R28  124.84,75.18 0 top
R29  121.67,78.11 180 top
R30  141.22,94.49 270 top
R31  134.11,81.03 0 top
R32  121.67,83.06 180 top
R33  125.35,81.15 0 top
R34  121.67,86.11 180 top
R35  127.76,75.18 0 top
R36  121.67,75.56 180 top
R37  137.03,81.03 0 top
R38  121.67,80.64 180 top
R39  131.19,81.15 0 top
R40  121.67,84.33 180 top
R41  128.27,81.15 0 top
R42  121.67,90.68 180 top
S1  137.16,115.7 0 top
SWDIO/SWDCLK/RESET  151.76,74.93 90 top
SWITCH_CONN  91.69,97.03 90 top
SWITCH_CONNECTOR  39-30-08?_S  [39-30-?08?]  27.18,106.43 180 top
U1  126.24,105.79 270 top
U2  131.83,92.08 270 top
U$1  69.85,26.04 90 top
U$2  22.35,26.04 90 top
U$3  117.47,26.04 90 top
U$6  70.99,110.49 180 top
U$8  85.47,97.16 90 top
Y1  116.97,100.08 0 top
Y2  137.16,101.47 0 top
Y3  140.72,98.04 0 top

### Tracks (layer width: path | path; a pad name or v marks a point on that pad's centre or on a via)
3.3V  (via drill 0.35)  (60 unrouted)
  Top 0.152: U2.32 127.1,88.33 v127.42,88.65 | U2.19 126.14,94.81 v124.78,94.81 | v136.27,96.01 136.53,96.01 136.78,95.76 137.43,95.76 U2.64 | U2.13 129.58,96.86 131.19,95.25 v131.57,95.25 | v136.53,86.61 136.32,86.41 | R1.2 117.86,116.33 123.21,110.98 123.72,110.98 123.99,110.71
  Top 0.508: Q1.1 129.91,75.26 R25.1 | Q5.1 127.11,75.38 R35.1 | Q6.1 136.38,81.23 R37.1 | Q2.1 124.19,75.38 R28.1 | Q3.1 133.46,81.23 R31.1 | Q7.1 130.54,81.35 R39.1 | 124.19,77.2 v124.21,77.22 | v127.16,77.22 127.16,76.46 | 129.91,77.2 v129.92,77.22 | R33.1 124.7,81.35 Q4.1 124.7,82.79 v124.97,83.06 | v127.25,83.06 127.62,82.69 | v129.29,83.19 129.29,83.17 129.68,82.78 129.68,82.54 129.96,82.26 | 133.46,83.17 v133.48,83.19 | 136.38,83.16 v136.35,83.19 | Q8.1 127.62,81.35 R41.1 | SWDIO/SWDCLK/RESET.1 SWDIO/SWDCLK/RESET.2 136.04,74.93 120.78,59.67 120.78,31.88 U$3.55
  Bottom 0.152: 132.63,96.01 131.87,95.25 v131.57,95.25 | v127.42,88.65 127.42,89.74 | 125.13,94.45 v124.78,94.81 | 136.02,95.76 v136.27,96.01 | v136.53,86.61 136.53,87.97 C7.1
  Bottom 0.508: v124.21,77.22 v127.16,77.22 | v129.92,77.22 v127.16,77.22 | v129.29,83.19 129.29,82.93 128.75,82.4 127.91,82.4 v127.25,83.06 v124.97,83.06 125.73,82.3 125.73,78.64 v127.16,77.22 | v133.48,83.19 134.11,82.55 134.11,79.38 135.25,78.23 135.25,76.96 | 135.25,76.96 135.32,77.03 137.45,77.03 138.05,77.63 138.05,78.99 137.29,79.76 137.29,82.25 v136.35,83.19 | 135.25,76.96 130.81,72.52 127.38,72.52 | v127.16,77.22 127.16,72.74 127.38,72.52 | 127.38,72.52 124.59,69.72 120.02,69.72 119.13,68.83 119.13,31.75 118.49,31.11 U$3.54 | v136.27,96.01 136.94,95.34 R15.1 139.95,91.1 R16.1
  other vias: 139.95,95.34 139.57,90.72
3.3V_ON/OFF  (via drill 0.35)  (1 unrouted)
  Top 0.152: U$3.14 115.99,59.05 117.04,58.01 118.43,58.01 139.75,79.33 139.75,84 140.97,85.22 v140.97,86.61 | v135.13,91.31 133.73,92.71 133.73,95.5 132.97,96.27 132.59,96.27 132.08,96.77 U2.8
  Bottom 0.152: U$2.14 18.77,60.33 63.73,60.33 U$1.14 66.27,60.33 111.35,60.33 U$3.14 | v140.97,86.61 140.97,87.12 142.24,88.39 143,88.39 144.02,89.41 144.02,89.79 143.76,90.04 139.33,90.04 139.06,90.31 136.76,90.31 135.76,91.31 v135.13,91.31
5V  (via drill 0.35)  (18 unrouted)
  Top 0.508: P1.1 2.67,103 2.67,60.45 9.14,53.98 U$2.12 | R26.1 122.9,72.52 v125.09,72.52 | R29.1 122.52,76.71 | 122.52,76.71 R36.1 | 122.52,76.71 121.79,76.71 v121.67,76.83 | R38.1 122.43,80.73 v122.43,81.67 | R40.1 R32.1 v123.57,83.06 | 122.52,86.4 R34.1 121.28,87.34 v121.28,87.5 | 122.52,90.48 R42.1 122.9,90.3 v123.44,90.3
  Bottom 0.508: v122.43,81.67 122.31,81.79 119.76,81.79 119.25,81.28 | 119.25,81.28 119.25,77.85 120.27,76.83 | 120.27,76.83 v121.67,76.83 | v123.57,83.06 120.02,83.06 119.25,82.3 | 119.25,82.3 119.25,81.28 | v121.28,87.5 120.27,88.52 119.63,88.52 119.25,88.14 | 119.25,88.14 119.25,82.3 | v123.44,90.3 122.94,90.81 121.28,90.81 120.78,91.31 119.25,91.31 118.87,90.93 118.87,88.52 119.25,88.14 | 120.27,76.83 119.04,75.61 116.76,75.61 116.08,74.93 116.08,70.48 | U$3.44 116.08,57.91 116.08,70.48 | v125.09,72.52 123.06,70.48 116.08,70.48
5V_ON/OFF  (via drill 0.35)  (1 unrouted)
  Top 0.152: v122.56,95.5 122.66,95.61 v122.66,97.54 | v136.4,97.79 136.4,97.28 135.76,96.65 135.38,96.65 135.08,96.95 U2.2
  Bottom 0.152: U$2.15 18.77,62.87 63.73,62.87 U$1.15 66.27,62.87 111.35,62.87 U$3.15 114.86,63.83 114.86,95.5 115.21,95.86 122.2,95.86 v122.56,95.5 | v122.66,97.54 123.22,98.09 126.11,98.09 127.94,99.92 129.31,99.92 129.67,99.57 134.62,99.57 v136.4,97.79
12V_ON/OFF  (via drill 0.35)  (1 unrouted)
  Top 0.152: v123.22,93.67 124.01,93.67 124.71,92.96 124.71,92.09 125.48,91.33 U2.26
  Bottom 0.152: U$2.16 18.77,65.41 63.73,65.41 U$1.16 66.27,65.41 111.35,65.41 U$3.16 114.55,66.06 114.55,95.63 115.09,96.16 122.78,96.16 123.22,95.73 v123.22,93.67
ACOUSTIC_ON/OFF  (1 unrouted)
  Bottom 0.152: U$2.17 18.77,67.94 63.73,67.94 U$1.17 66.27,67.94 111.35,67.94 U$3.17
BACKPLANE_SCL  (via drill 0.35)  (1 unrouted)
  Top 0.152: v25.4,89.53 26.67,90.81 68.58,90.81 U$1.31 71.12,90.81 116.2,90.81 U$3.31 117.55,89.61 122.3,89.61 122.42,89.49 122.42,87.64 123.01,87.05 127.54,87.05 129.52,89.03 135.76,89.03 136.53,89.79 136.53,92.66 136.69,92.83 U2.58 139.16,92.83 R16.2
  Bottom 0.152: U$2.31 v25.4,89.53
BACKPLANE_SDA  (via drill 0.35)  (1 unrouted)
  Top 0.152: v25.4,87 26.67,88.27 68.58,88.27 U$1.32 71.12,88.27 116.2,88.27 U$3.32 119.25,85.22 125.35,85.22 v125.62,85.49 | R15.2 139.64,93.33 U2.59 136.63,93.33 136.21,92.9 136.21,90.11 136.22,90.09 136.22,90.04 135.51,89.33 129.34,89.33 127.92,87.91 125.98,87.91 v125.73,87.66
  Bottom 0.152: U$2.32 v25.4,87 | v125.73,87.66 125.73,87.53 125.62,87.42 v125.62,85.49
CONTROL_SIGNAL  (via drill 0.35)  (2 unrouted)
  Top 0.152: U$2.7 18.77,42.55 63.73,42.55 U$1.7 66.27,42.55 111.35,42.55 U$3.7 | U2.9 131.58,96.63 v132.84,95.36
D+
  Top 0.152: U2.45 134.08,87.08 134.87,87.88 136.33,87.88 136.63,87.58 140.46,87.58 144.16,91.28 144.16,105 144.78,105.61 151.81,105.61 152.35,106.15 152.35,108.74 152.21,108.87 150.88,108.87 150.59,109.16 150.59,112.51 151.06,112.98 151.06,114.3 150.16,115.21 148.88,115.21 147.98,114.3 147.98,113.18 147.32,112.52 J1.D+
D-
  Top 0.152: 148.12,109.94 J1.D- 148.12,109.69 149.22,108.58 149.22,107.31 147.83,105.92 144.65,105.92 143.86,105.12 143.86,91.41 140.41,87.96 136.69,87.96 136.53,88.11 136.53,88.13 136.4,88.27 134.75,88.27 133.58,87.09 U2.44
GND  (via drill 0.35)  (86 unrouted)
  other vias: 141.22,93.64
  pour Bottom: 0,120.65 0,0 154.18,0 154.18,120.65
ISOLATION
  cutout Bottom: 14.73,97.16 14.73,50.16 120.02,50.16 120.02,97.16
  cutout Bottom: 17.53,32.38 14.73,32.38 14.73,23.5 120.02,23.5 120.02,32.38
JETSON_ON/OFF  (via drill 0.35)  (1 unrouted)
  Top 0.152: U2.11 130.58,97.09 | U2.11 130.56,97.77 | U2.11 130.58,97.06 130.94,96.71 v130.94,96.48
  Bottom 0.152: U$2.18 18.77,70.48 63.73,70.48 U$1.18 66.27,70.48 111.35,70.48 U$3.18 114.17,70.76 114.17,95.76 114.88,96.47 123.19,96.47 123.2,96.48 v130.94,96.48
KILL_SWITCH  (via drill 0.35)  (2 unrouted)
  Top 0.152: U$2.37 21.08,74.3 20.55,74.83 20.55,97.86 18.54,99.87 18.54,101.85 20.32,103.63 33.02,103.63 33.47,104.08 SWITCH_CONNECTOR.4 | v25.4,74.3 26.67,75.56 68.58,75.56 U$1.37 71.12,75.56 116.2,75.56 U$3.37 | v128.02,84.99 128.08,85.05 U2.33 | v127.94,73.3 127.92,73.28 v126.37,73.28
  Bottom 0.152: U$2.37 v25.4,74.3 | v128.02,84.99 128.53,84.99 130.25,83.27 130.25,79.63 131.78,78.11 131.78,74.47 130.63,73.33 130.61,73.3 | U$3.37 118.49,73.28 v126.37,73.28 | 130.59,73.28 130.61,73.3 | 130.61,73.3 v127.94,73.3
MOBO_ON/OFF  (via drill 0.35)  (1 unrouted)
  Top 0.152: U2.10 131.06,97.76 131.06,98.68 130.99,98.75 130.05,98.75 129.79,99.01 v129.37,99.01
  Bottom 0.152: U$2.19 18.77,73.03 63.73,73.03 U$1.19 66.27,73.03 111.35,73.03 U$3.19 113.79,72.92 113.79,95.89 114.68,96.77 123.06,96.77 124.08,97.79 126.24,97.79 128.06,99.62 128.57,99.62 129.17,99.01 v129.37,99.01
N$1
  pour Top: 14.73,32.38 14.73,23.5 120.02,23.5 120.02,32.38
N$2
  pour Top: 17.53,57.78 14.73,57.78 14.73,50.16 120.02,50.16 120.02,57.66 120.02,57.78 117.22,57.78
N$3
  cutout Bottom: 14.73,42.55 14.73,40.01 24.89,40.01 24.89,42.55
N$4
  Top 0.152: C14.1 119.13,104.65 119.73,104.04 U1.22
N$5
  cutout Bottom: 62.23,42.55 62.23,40.01 72.39,40.01 72.39,42.55
N$6
  cutout Bottom: 109.86,42.55 109.86,40.01 120.02,40.01 120.02,42.55
N$8
  Top 0.152: D5.C 146.39,107.31 R20.1
N$9
  Top 0.152: R22.1 123.86,99.82 | 123.86,99.82 123.86,100.24 124.1,100.47 125.73,100.47 125.99,100.73 U1.30 | 123.86,99.82 123.61,100.08 Y1.2 119.51,101.31 117.56,103.25 C15.1
N$10
  Top 0.152: U1.31 126.49,100.62 R22.2 | Y1.1 117.41,100.08 118.57,98.92 124.78,98.92 R22.2 | C16.1 125.56,98.3 R22.2
N$11  (via drill 0.35)
  Top 0.152: P2.L4 115.88,117.68 116.59,116.97 116.59,115.44 117.86,114.17 v117.86,109.52 | U1.25 122.99,102.11 119.73,102.11 v118.36,103.48
  Bottom 0.152: v117.86,109.52 118.36,109.01 v118.36,103.48
N$12  (via drill 0.35)
  Top 0.152: U1.27 124.62,101.74 124.62,102.49 124.75,102.62 128.4,102.62 128.91,103.13 v128.91,103.25
  Bottom 0.152: P2.L2 109.53,117.67 110.87,116.33 117.86,116.33 123.19,111 124.21,111 124.46,110.74 124.46,108.97 124.59,108.84 128.27,108.84 128.91,108.2 v128.91,103.25
N$13
  Top 0.152: 121.74,105.04 U1.20 121.06,105.04 C13.1
N$14
  Top 0.152: U1.10 124.49,111.77 R19.2
N$15
  Top 0.152: R23.1 98.57,116.17 P2.L1
N$16
  Top 0.152: R1.1 108.86,116.33 P2.L3
N$17
  Top 0.152: C17.1 132.8,100.11 133.08,99.84 U2.6 133.08,99.93 Y2.1
N$18
  Top 0.152: C18.1 139.7,104.36 Y2.2 137.72,99.49 134.54,99.49 133.58,98.52 U2.5
N$19
  Top 0.152: C20.2 136.52,85.3 135.42,85.3 135.08,85.64 U2.47
N$20
  Top 0.152: U2.31 125.44,88.83 C19.2
N$21
  Top 0.152: Y3.P$1 139.12,98.39 C21.1 137.45,98.39 136.65,99.19 134.84,99.19 134.08,98.42 U2.4
N$22
  Top 0.152: R5.2 128.23,112.01 129.2,112.01 R6.2 129.41,112.05 130.56,112.05 C25.2
N$23
  Top 0.152: U1.2 128.52,109.94 | R3.2 131.95,111.51 131.57,111.12 128.78,111.12 128.49,110.83 U1.2 | U1.2 128.48,108.97 128.04,108.53 123.31,108.53 122.93,108.91 115.01,108.91 112.52,106.43 P2.R1
N$24
  Top 0.152: R2.2 129.13,110.11 U1.1 128.99,108.92 128.27,108.2 123.57,108.2 123.19,107.82 123.19,102.93 122.93,102.67 120.09,102.67 118.62,104.14 108.33,104.14 P2.R2
N$25
  Top 0.152: P2.R7 101.73,110.87 109.47,118.62 122.14,118.62 C26.2
N$26
  Top 0.152: U1.6 126.49,111.3 R5.1 C26.1
N$27
  Top 0.152: R6.1 129.29,113.67 128.91,114.05 127.51,114.05 126.99,113.53 U1.5 126.99,109.23 126.6,108.83 123.44,108.83 122.81,109.47 122.81,110.74 121.16,112.39 C27.2
N$28
  Top 0.152: C27.1 113.88,115.52 109.48,115.52 107.87,113.91 107.87,105.58 107.11,104.82 101.21,104.82 100.46,104.06 P2.R8
N$29
  Top 0.152: Y3.P$2 142.31,98.39 C22.1 | Y3.P$2 141.84,98.17 | U2.3 134.58,98.49 134.97,98.88 136.4,98.88 137.16,98.12 137.16,97.78 137.4,97.54 138.44,97.54 138.74,97.24 138.74,97.05 138.89,96.9 140.82,96.9 Y3.P$2
N$30
  Top 0.152: U2.60 138.53,93.83 139.19,94.49 140.72,94.49 141.22,95 R30.1
N$34
  Top 0.152: 132.08,104.52 C24.2 | C24.2 C23.2 132.5,109.51 133.9,110.91 R27.1 S1.3 | C24.2 131.44,103.47 131.44,101.09 131.32,100.97 130.03,100.97 129.79,100.73 129.79,99.44 130.18,99.06 131.94,99.06 132.58,98.42 U2.7
NET_RESET  (via drill 0.35)
  Top 0.152: U1.37 129.97,102.59 129.96,102.59 129.73,102.36 129.67,102.36 129.41,102.11 129.41,100.11 v128.32,99.01 | v124.71,97.14 123.7,96.12 123.7,94.74 125.09,93.34 125.09,92.21 125.48,91.83 U2.25
  Bottom 0.152: v128.32,99.01 126.72,97.41 124.98,97.41 v124.71,97.14
PLTA_ON/OFF  (via drill 0.35)  (1 unrouted)
  Top 0.152: U$3.50 116.2,40.01 71.12,40.01 U$1.50 68.58,40.01 23.62,40.01 U$2.50 21.08,40.01 15.37,40.01 14.1,41.27 v14.1,53.19 | SWITCH_CONNECTOR.1 20.26,106.43 14.1,100.27 v14.1,54.86
  Bottom 0.152: v14.1,54.86 v14.1,53.19
PWM_1  (1 unrouted)
  Top 0.152: U$3.20 115.95,74.3 117.35,72.9 R26.2 120.82,73.57 121.16,73.91 129.94,73.91 130.56,74.54 130.56,76.79 Q1.3
  Bottom 0.152: U$2.20 18.77,75.56 63.73,75.56 U$1.20 66.27,75.56 111.35,75.56 U$3.20
PWM_2  (1 unrouted)
  Top 0.152: U$3.21 115.95,76.83 117.22,75.56 120.65,75.56 | 120.65,75.56 R36.2 | Q5.3 127.76,74.66 127.38,74.28 121.94,74.28 120.65,75.56
  Bottom 0.152: U$2.21 18.77,78.11 63.73,78.11 U$1.21 66.27,78.11 111.35,78.11 U$3.21
PWM_3  (1 unrouted)
  Top 0.152: U$3.22 115.95,79.38 117.22,78.11 R29.2 | R29.2 120.9,78.02 | 125.11,78.54 124.89,78.31 | 124.89,78.31 Q2.3 | R29.2 120.82,78.14 121.67,78.99 124.21,78.99 124.89,78.31
  Bottom 0.152: U$2.22 18.77,80.64 63.73,80.64 U$1.22 66.27,80.64 111.35,80.64 U$3.22
PWM_3V3_1  (via drill 0.35)
  Top 0.152: R25.2 131.21,75.51 Q1.2 131.21,77.61 132.16,78.56 137.87,78.56 139.45,80.14 139.45,84.95 139.7,85.2 v139.7,85.33 | U2.61 138.39,94.33 139.06,95 139.06,95.89 139.45,96.27 141.81,96.27 142.06,96.01 142.06,90.96 v140.18,89.07
  Bottom 0.152: v140.18,89.07 140.18,85.81 v139.7,85.33
PWM_3V3_2  (via drill 0.35)
  Top 0.152: R35.2 128.41,75.38 Q5.2 128.41,77.74 129.54,78.87 137.53,78.87 138.92,80.25 138.92,80.29 138.92,85.09 v138.79,85.22 | U2.62 138.39,94.83 138.68,95.12 138.68,96.01 139.27,96.6 141.91,96.6 142.37,96.14 142.37,90.4 140.3,88.34 139.7,88.34 v139.27,88.77
  Bottom 0.152: v139.27,88.77 138.68,88.19 138.68,85.45 138.79,85.34 v138.79,85.22
PWM_3V3_3
  Top 0.152: U2.35 129.08,85.3 129.69,84.69 138.12,84.69 138.61,84.2 138.61,80.38 137.48,79.25 126.75,79.25 125.49,77.99 Q2.2 125.49,75.26 125.69,75.06 R28.2
PWM_3V3_4  (via drill 0.35)
  Top 0.152: U2.36 129.58,85.44 130.01,85 137.21,85 v137.67,85.46 | R37.2 137.68,81.23 Q6.2 137.79,82.37 v137.79,83.31
  Bottom 0.152: v137.79,83.31 137.79,85.33 v137.67,85.46
PWM_3V3_5  (via drill 0.35)
  Top 0.152: R31.2 134.76,81.23 Q3.2 v134.76,83.3 | U2.14 129.08,96.78 132.97,92.89 132.97,92.71 v133.1,92.71
  Bottom 0.152: v133.1,92.71 133.22,92.58 133.22,84.84 v134.76,83.3
PWM_3V3_6  (via drill 0.35)
  Top 0.152: R39.2 132.04,82.06 Q7.2 131.84,83.17 v131.83,83.19 | v129.3,94.73 129.3,96.12 128.58,96.85 U2.15
  Bottom 0.152: v131.83,83.19 131.83,92.2 v129.3,94.73
PWM_3V3_7  (via drill 0.35)
  Top 0.152: R33.2 126.2,82.06 Q4.2 126,84.34 | 126,84.34 | 126,84.34 126,84.85 127.02,85.87 v127.25,85.87 | v128.65,95.63 128.71,95.69 128.71,96.21 128.08,96.84 U2.16
  Bottom 0.152: v127.25,85.87 128.27,86.89 128.27,94.87 128.65,95.25 v128.65,95.63
PWM_3V3_8  (via drill 0.35)
  Top 0.152: R41.2 129.12,82.06 Q8.2 128.92,82.53 v128.27,83.19 | v124.46,95.76 124.53,95.83 U2.17
  Bottom 0.152: v128.27,83.19 127.64,83.82 127.64,84.45 126.36,85.72 126.36,88.52 123.83,91.06 123.83,95.12 v124.46,95.76
PWM_4  (1 unrouted)
  Top 0.152: U$3.23 115.95,81.92 117.22,80.64 R38.2 121.24,80.22 121.24,80.12 121.8,79.56 136.19,79.56 136.96,80.33 136.96,84.04 Q6.3 137.16,84.24
  Bottom 0.152: U$2.23 18.77,83.19 63.73,83.19 U$1.23 66.27,83.19 111.35,83.19 U$3.23
PWM_5  (1 unrouted)
  Top 0.152: U$3.24 115.82,84.45 117.22,83.06 120.65,83.06 | 120.65,83.06 R32.2 | Q3.3 134.11,80.5 133.48,79.87 121.92,79.87 121.55,80.24 121.55,81.29 121.54,81.3 121.54,82.17 120.65,83.06
  Bottom 0.152: U$2.24 18.77,85.72 63.73,85.72 U$1.24 66.27,85.72 111.35,85.72 U$3.24
PWM_6  (1 unrouted)
  Top 0.152: U$3.25 115.82,87 116.97,85.85 117.6,85.85 119.13,84.33 R40.2 121.2,84.33 121.55,83.98 121.55,82.66 121.92,82.28 123,82.28 123.32,81.96 123.32,80.9 123.84,80.37 130.94,80.37 131.19,80.63 Q7.3
  Bottom 0.152: U$2.25 18.77,88.27 63.73,88.27 U$1.25 66.27,88.27 111.35,88.27 U$3.25
PWM_7  (via drill 0.35)  (1 unrouted)
  Top 0.152: U$3.26 113.13,89.03 116.2,89.03 116.97,88.27 118.66,88.27 R34.2 120.14,86.78 v120.14,87.5 | v124.46,84.45 125,84.45 Q4.3
  Bottom 0.152: U$2.26 18.77,90.81 63.73,90.81 U$1.26 66.27,90.81 111.35,90.81 U$3.26 | v120.14,87.5 120.78,86.87 121.79,86.87 124.21,84.45 v124.46,84.45
PWM_8  (via drill 0.35)  (1 unrouted)
  Top 0.152: R42.2 120.69,90.81 120.27,90.81 | 120.27,90.81 116.97,90.81 116.2,91.57 113.13,91.57 U$3.27 | Q8.3 128.18,84.2 v126.87,84.2 | v119.76,90.3 120.27,90.81
  Bottom 0.152: U$2.27 18.77,93.34 63.73,93.34 U$1.27 66.27,93.34 111.35,93.34 U$3.27 | v126.87,84.2 126.32,84.75 125.49,84.75 120.4,89.85 120.33,89.85 119.89,90.3 v119.76,90.3
ROBOT_SCL  (via drill 0.35)  (1 unrouted)
  Top 0.152: v25.4,94.61 26.67,95.89 68.58,95.89 U$1.29 | U$1.29 71.12,95.89 116.2,95.89 U$3.29 121.41,94.61 123.7,92.33 R18.2 123.79,91.99 124.59,91.19 124.59,90.17 124.93,89.83 U2.29 | 70.1,94.87 U$1.29 | P3.4 43.61,100.91 41.5,103.02 23.9,103.02 22.99,102.11 22.99,95.25 U$2.29
  Bottom 0.152: U$2.29 v25.4,94.61
ROBOT_SDA  (via drill 0.35)  (1 unrouted)
  Top 0.152: v25.4,92.08 26.67,93.34 68.58,93.34 U$1.30 71.12,93.34 116.2,93.34 U$3.30 118.11,91.44 120.08,91.44 120.09,91.46 123.81,91.46 124.17,91.1 124.17,89.03 | U2.30 124.63,89.33 124.33,89.03 124.17,89.03 | R17.2 123.66,89.03 124.17,89.03 | P3.2 41.41,103.33 20.45,103.33 18.85,101.73 18.85,100 20.85,97.99 20.85,93.07 21.84,92.08 U$2.30
  Bottom 0.152: U$2.30 v25.4,92.08
SPARE2  (1 unrouted)
  Bottom 0.152: U$2.28 18.77,95.89 63.73,95.89 U$1.28 66.27,95.89 111.35,95.89 U$3.28
SPARE3  (via drill 0.35)  (1 unrouted)
  Top 0.152: v25.4,84.45 26.67,85.72 68.58,85.72 U$1.33 71.12,85.72 116.2,85.72 U$3.33
  Bottom 0.152: U$2.33 v25.4,84.45
SPARE4  (via drill 0.35)  (1 unrouted)
  Top 0.152: v25.4,81.92 26.67,83.19 68.58,83.19 U$1.34 71.12,83.19 116.2,83.19 U$3.34
  Bottom 0.152: U$2.34 v25.4,81.92
SPARE5  (via drill 0.35)  (1 unrouted)
  Top 0.152: v25.4,79.38 26.67,80.64 68.58,80.64 U$1.35 71.12,80.64 116.2,80.64 U$3.35
  Bottom 0.152: U$2.35 v25.4,79.38
SPARE6  (via drill 0.35)  (1 unrouted)
  Top 0.152: v25.4,76.83 26.67,78.11 68.58,78.11 U$1.36 71.12,78.11 116.2,78.11 U$3.36
  Bottom 0.152: U$2.36 v25.4,76.83
SPARE7  (1 unrouted)
  Top 0.152: U$2.43 25.4,59.05 26.67,60.33 68.58,60.33 U$1.43 71.12,60.33 116.2,60.33 U$3.43
SPI_CLK
  Top 0.152: 127.51,101.59 U1.33 127.49,100.06 126.78,99.35 126.78,96.81 127.42,96.17 127.42,94.28 126.97,93.83 U2.21
SPI_MISO
  Top 0.152: 128.02,101.58 U1.34 127.99,100.05 127.09,99.15 127.09,96.93 127.73,96.29 127.73,94.07 126.98,93.33 U2.22
SPI_MOSI
  Top 0.152: U1.35 128.49,100.04 127.39,98.95 127.39,97.06 128.03,96.42 128.03,93.95 126.91,92.83 U2.23
SPI_SS
  Top 0.152: U1.32 126.99,100.09 126.48,99.58 126.48,96.68 127.12,96.04 127.12,94.61 126.84,94.33 U2.20
SWCLK  (via drill 0.35)
  Top 0.152: 137.5,88.39 U2.49 138.17,88.33 138.46,88.61 138.46,89.36 v138.81,89.71 | v143.14,89.4 146.18,86.36 150.5,86.36 SWDIO/SWDCLK/RESET.9
  Bottom 0.152: v138.81,89.71 142.83,89.71 v143.14,89.4
SWDIO
  Top 0.152: 150.56,83.76 150.5,83.82 147.7,83.82 147.32,84.2 145.16,84.2 142.09,87.27 136.51,87.27 136.28,87.5 135,87.5 134.87,87.37 134.86,87.37 134.58,87.08 U2.46 134.58,85.68 | 150.56,83.76 SWDIO/SWDCLK/RESET.7 | 150.55,83.75 150.56,83.76
SWITCH_1  (via drill 0.35)  (2 unrouted)
  Top 0.152: U$2.38 21.08,71.75 20.24,72.59 20.24,97.74 18.16,99.82 18.16,101.98 20.19,104.01 29.08,104.01 29.27,104.2 SWITCH_CONNECTOR.3 | v25.4,71.75 26.67,73.03 68.58,73.03 U$1.38 71.12,73.03 116.2,73.03 U$3.38 129.92,71.75 132.38,74.22 v132.38,77.93 | U2.34 128.58,85.29 129.54,84.33 130.05,84.33 v130.3,84.07
  Bottom 0.152: U$2.38 v25.4,71.75 | v130.3,84.07 130.56,83.82 130.56,82.17 130.56,79.76 v132.38,77.93
SWITCH_2  (via drill 0.35)  (2 unrouted)
  Top 0.152: U$2.39 21.34,69.22 19.94,70.61 19.94,97.54 17.78,99.69 17.78,102.11 20.07,104.39 24.89,104.39 25.08,104.58 SWITCH_CONNECTOR.2 | v25.4,69.22 26.67,70.48 68.58,70.48 U$1.39 71.12,70.48 116.2,70.48 U$3.39 127.89,69.22 133.29,74.62 v133.29,77.93 | U2.37 130.08,87.55 v130.16,87.63
  Bottom 0.152: U$2.39 v25.4,69.22 | v130.16,87.63 130.91,86.87 130.91,79.83 132.21,78.54 132.68,78.54 v133.29,77.93
SWITCH_3  (via drill 0.35)  (2 unrouted)
  Top 0.152: SWITCH_CONNECTOR.6 23.94,99.77 23.94,67.75 22.86,66.67 U$2.40 v23.71,66.67 | v25.4,66.67 26.67,67.94 68.58,67.94 U$1.40 71.12,67.94 116.2,67.94 U$3.40 125.78,66.67 134.31,75.2 v134.31,77.95 | U2.38 130.58,87.18 v131.06,87.67
  Bottom 0.152: v23.71,66.67 v25.4,66.67 | v131.06,87.67 131.22,87.52 131.22,80.54 133.22,78.54 133.73,78.54 v134.31,77.95
SWITCH_4  (via drill 0.35)  (2 unrouted)
  Top 0.152: SWITCH_CONNECTOR.7 29.27,98.87 29.01,98.6 27.36,98.6 24.32,95.57 24.32,65.15 23.3,64.14 | U$2.41 23.3,64.14 | 23.3,64.14 v24.09,64.14 | v25.4,64.14 26.67,65.41 68.58,65.41 U$1.41 71.12,65.41 116.2,65.41 U$3.41 123.7,64.14 136.36,76.8 v136.36,77.95 | v135.38,90.07 133.12,92.33 U2.24
  Bottom 0.152: v24.09,64.14 v25.4,64.14 | v135.38,90.07 135.36,90.05 135.36,78.95 v136.36,77.95
SWITCH_5  (via drill 0.35)  (2 unrouted)
  Top 0.152: SWITCH_CONNECTOR.8 33.47,98.87 32.89,98.3 27.56,98.3 24.7,95.44 24.7,62.42 23.88,61.59 | U$2.42 23.88,61.59 | 23.88,61.59 25.4,61.59 26.67,62.87 68.58,62.87 U$1.42 71.12,62.87 116.2,62.87 U$3.42 121.59,61.59 137.27,77.27 v137.27,77.95 | U2.27 132.97,90.83 v133.86,89.94
  Bottom 0.152: v133.86,89.94 133.86,90.07 134.47,90.68 135.76,90.68 137.41,89.03 137.41,86.23 135.67,84.49 135.67,79.56 v137.27,77.95
VBUS  (1 unrouted)
  Top 0.152: J1.VBUS 148.97,111.11 148.97,109.35 150.24,108.08 150.75,108.08
VBUS_3.3  (via drill 0.35)
  Top 0.152: R21.1 R20.2 142.66,106.13 143.38,105.41 143.38,100.2 143.13,99.95 v143.13,99.47 | v132.46,88.08 132.58,87.96 U2.42
  Bottom 0.152: v132.46,88.08 132.46,93.09 136.02,96.65 142.62,96.65 143.13,97.16 v143.13,99.47

### Text on the board
Reference: Yo we could prob / fit the battery balancer / board on here too